# EasyEDA Pro project modular_design.eprj, schematic Schematic1

## Sheets
1 P0_MCU_extend: Board Name: Board1; Create Date: 2026-06-22; Page Name: P0_MCU_extend; Project Name: modular_design; Schematic Name: Schematic1; Update Date: 2026-07-07; Add into BOM: yes; Company: 嘉立创EDA; Convert to PCB: yes; Page Size: A4; Version: V1.0
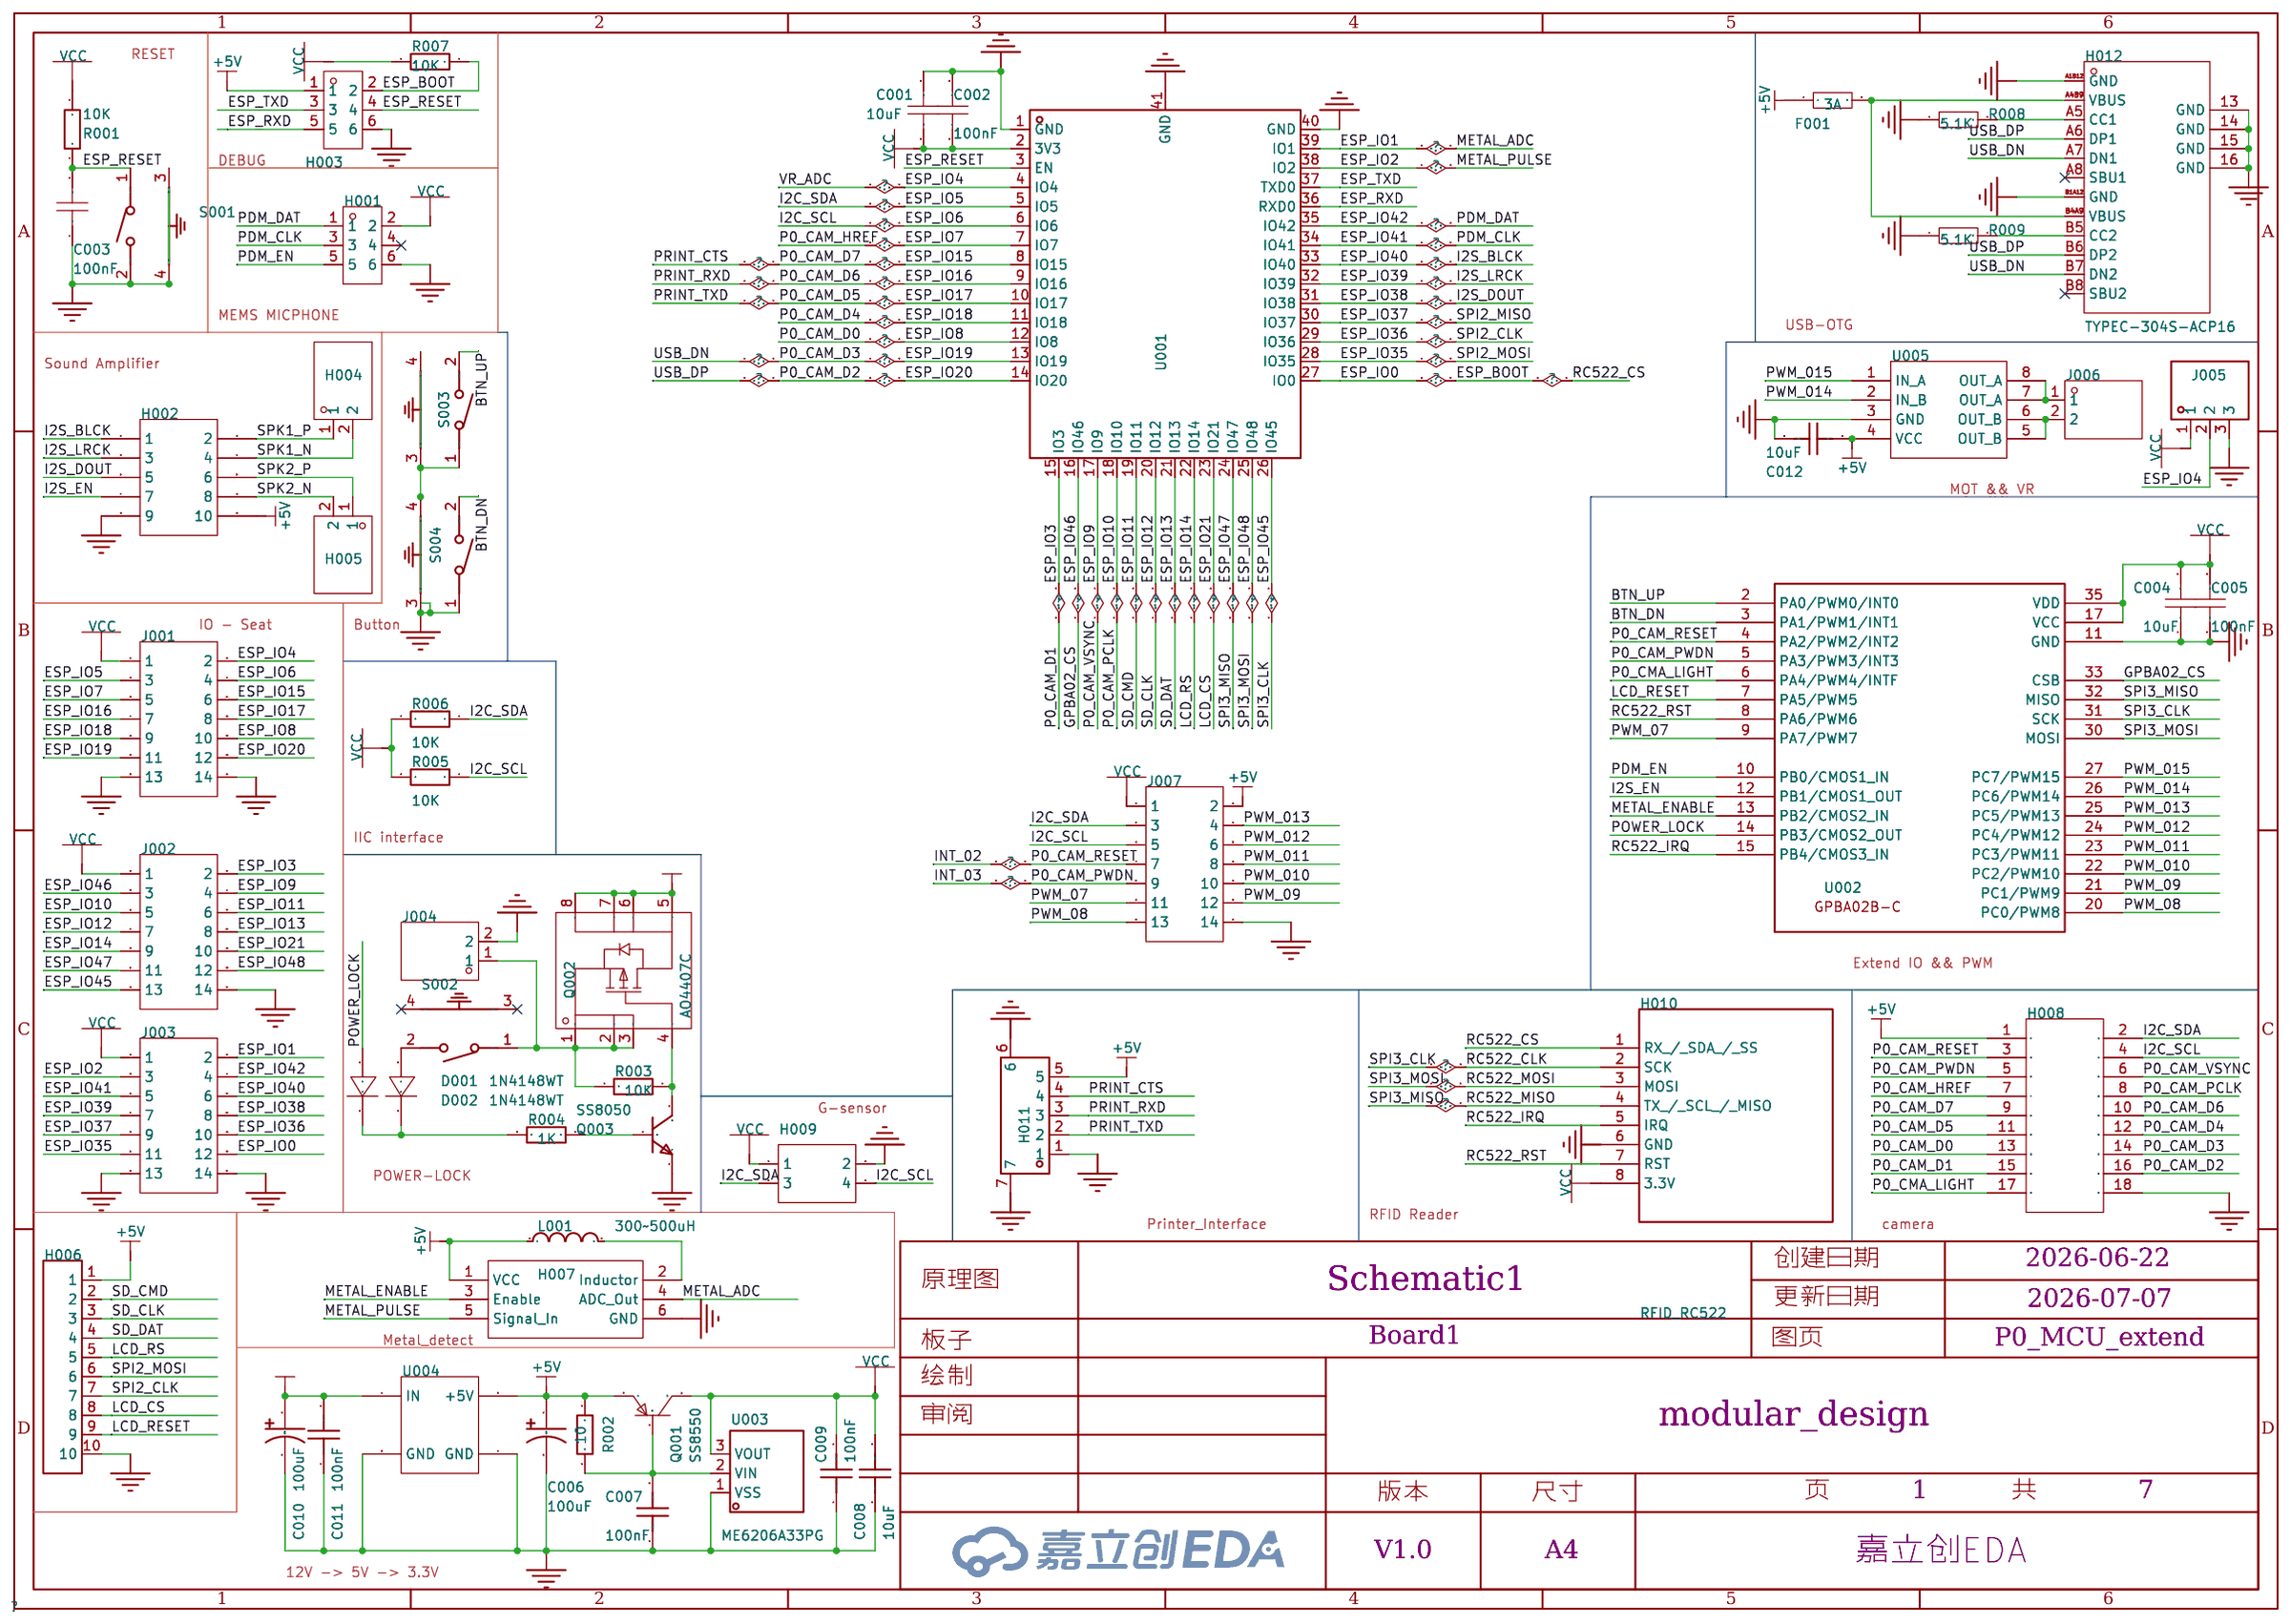
[diagram p0: P0_MCU_extend]
2 P1_mic_amp_debug: Create Date: 2026-06-24; Page Name: P1_mic_amp_debug
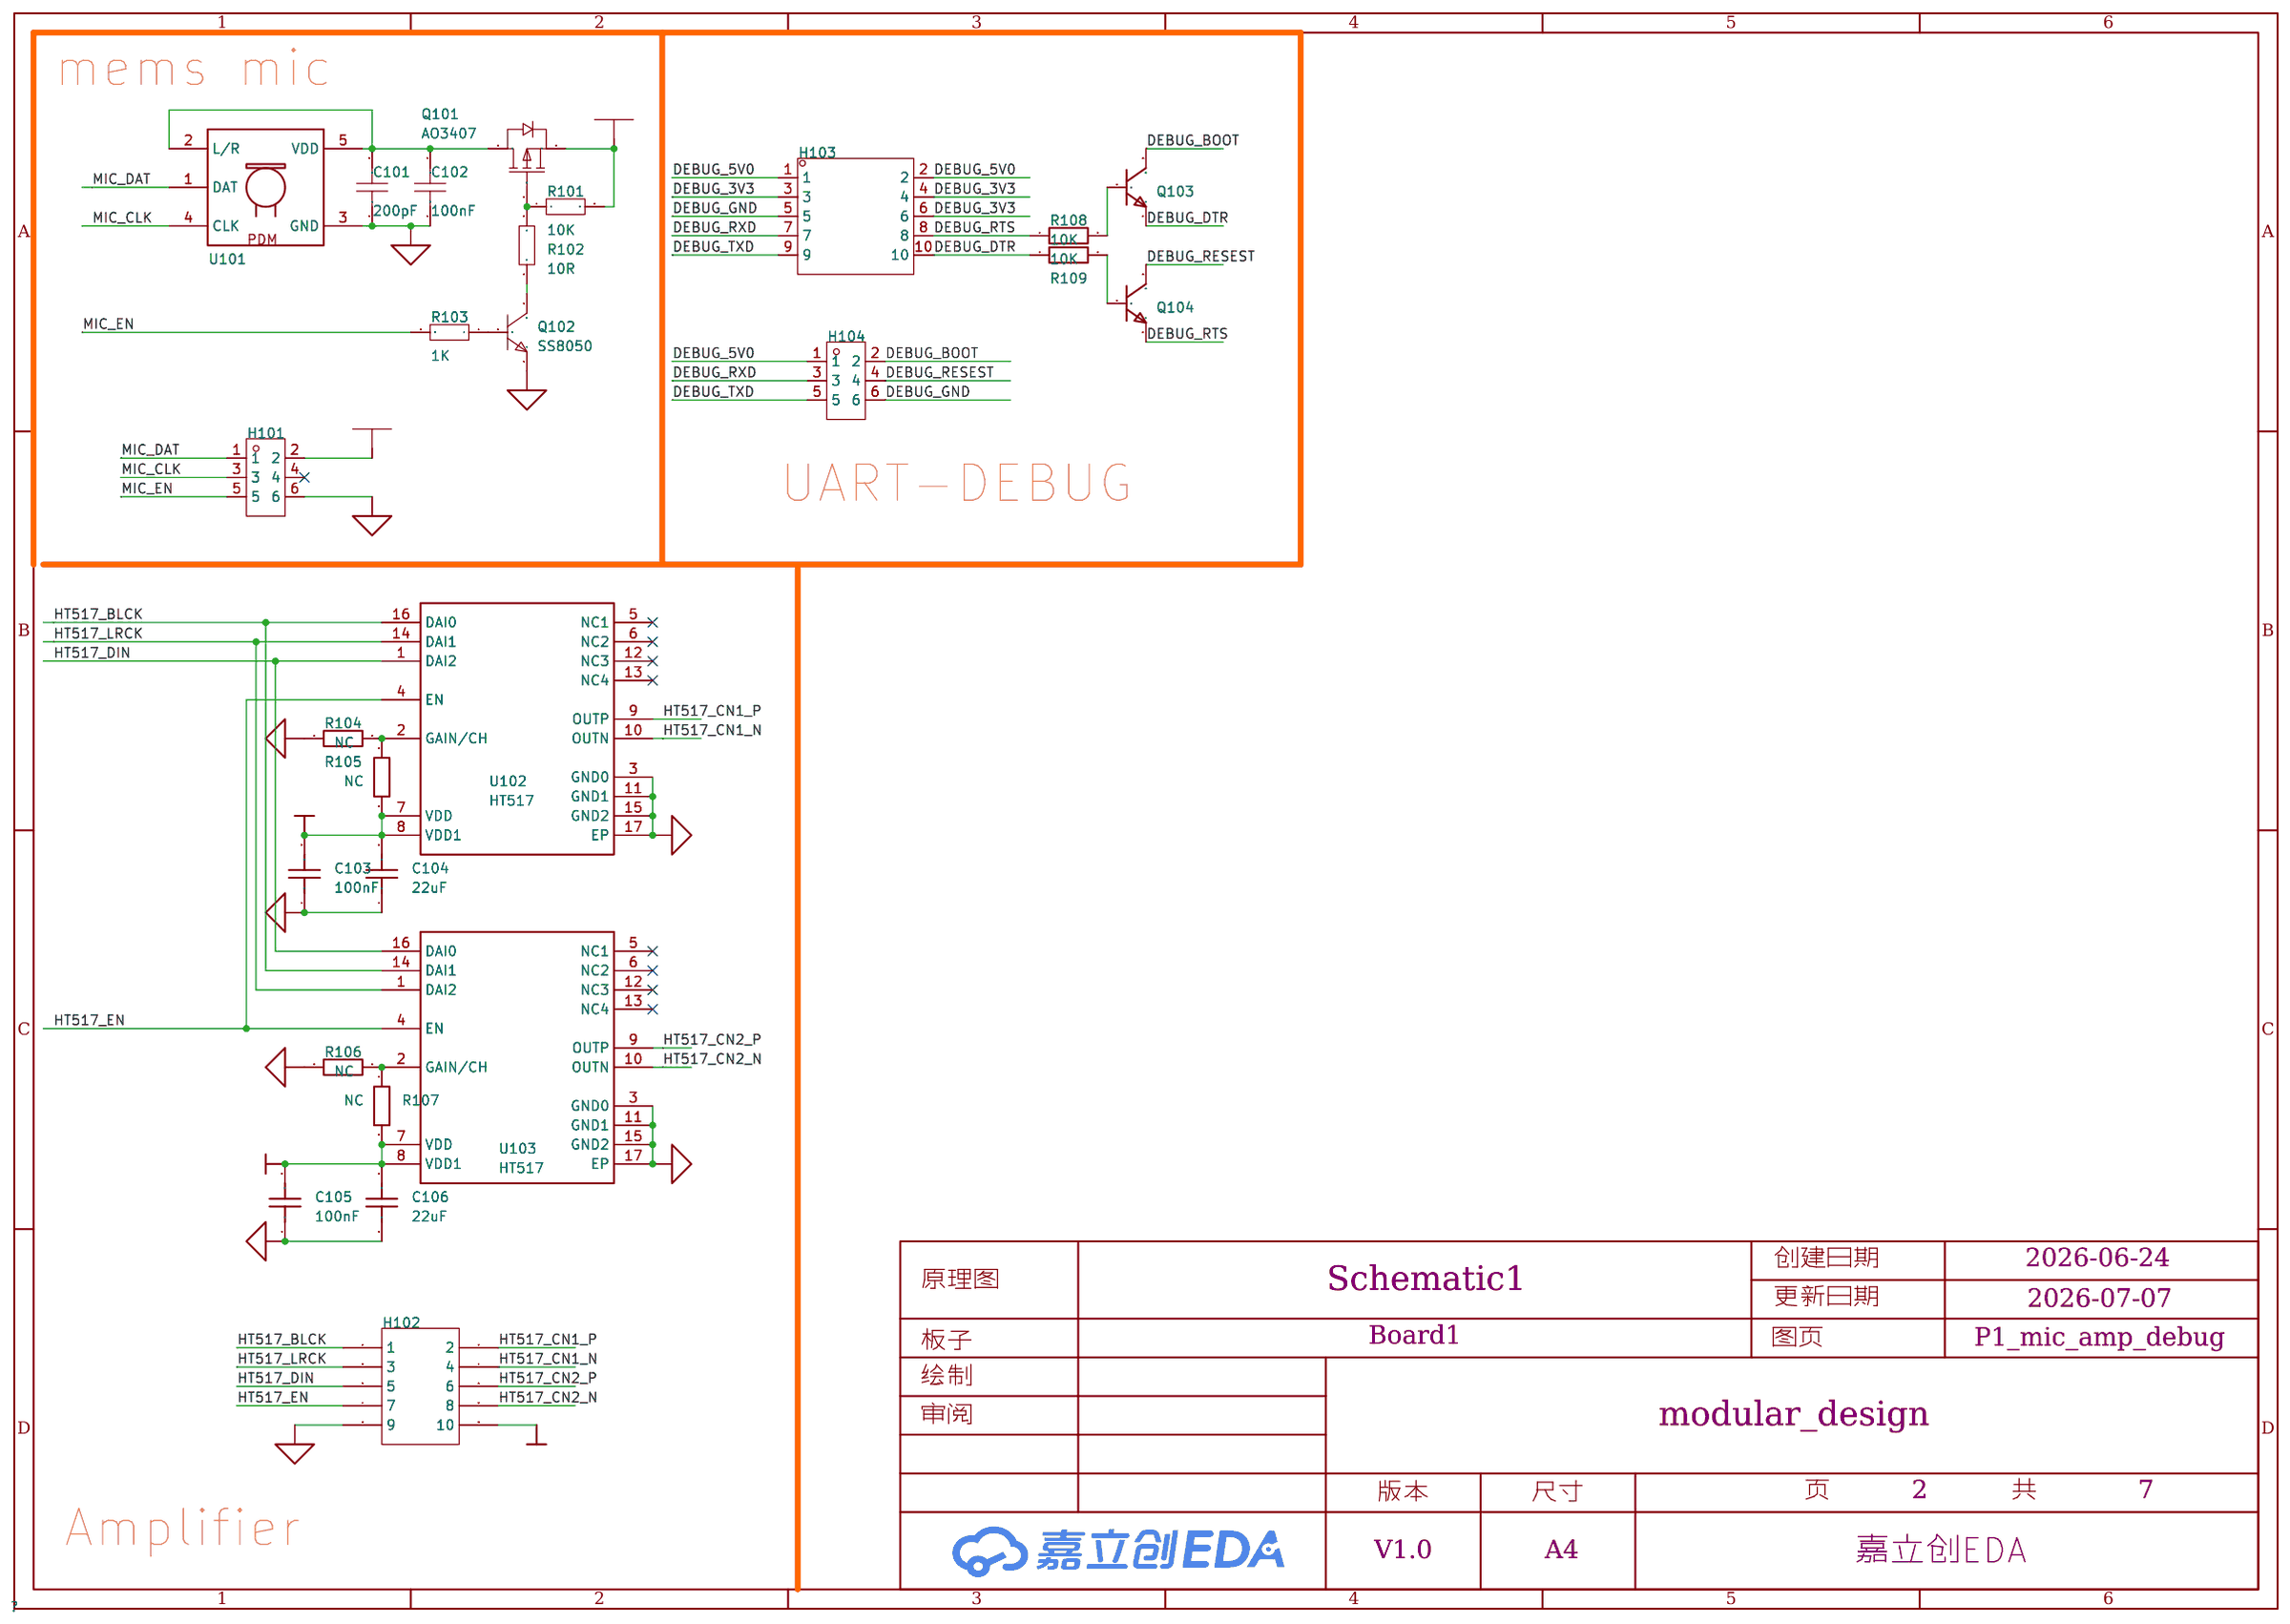
[diagram p1: P1_mic_amp_debug]
3 P2_LCD_SD: Create Date: 2026-06-30; Page Name: P2_LCD_SD
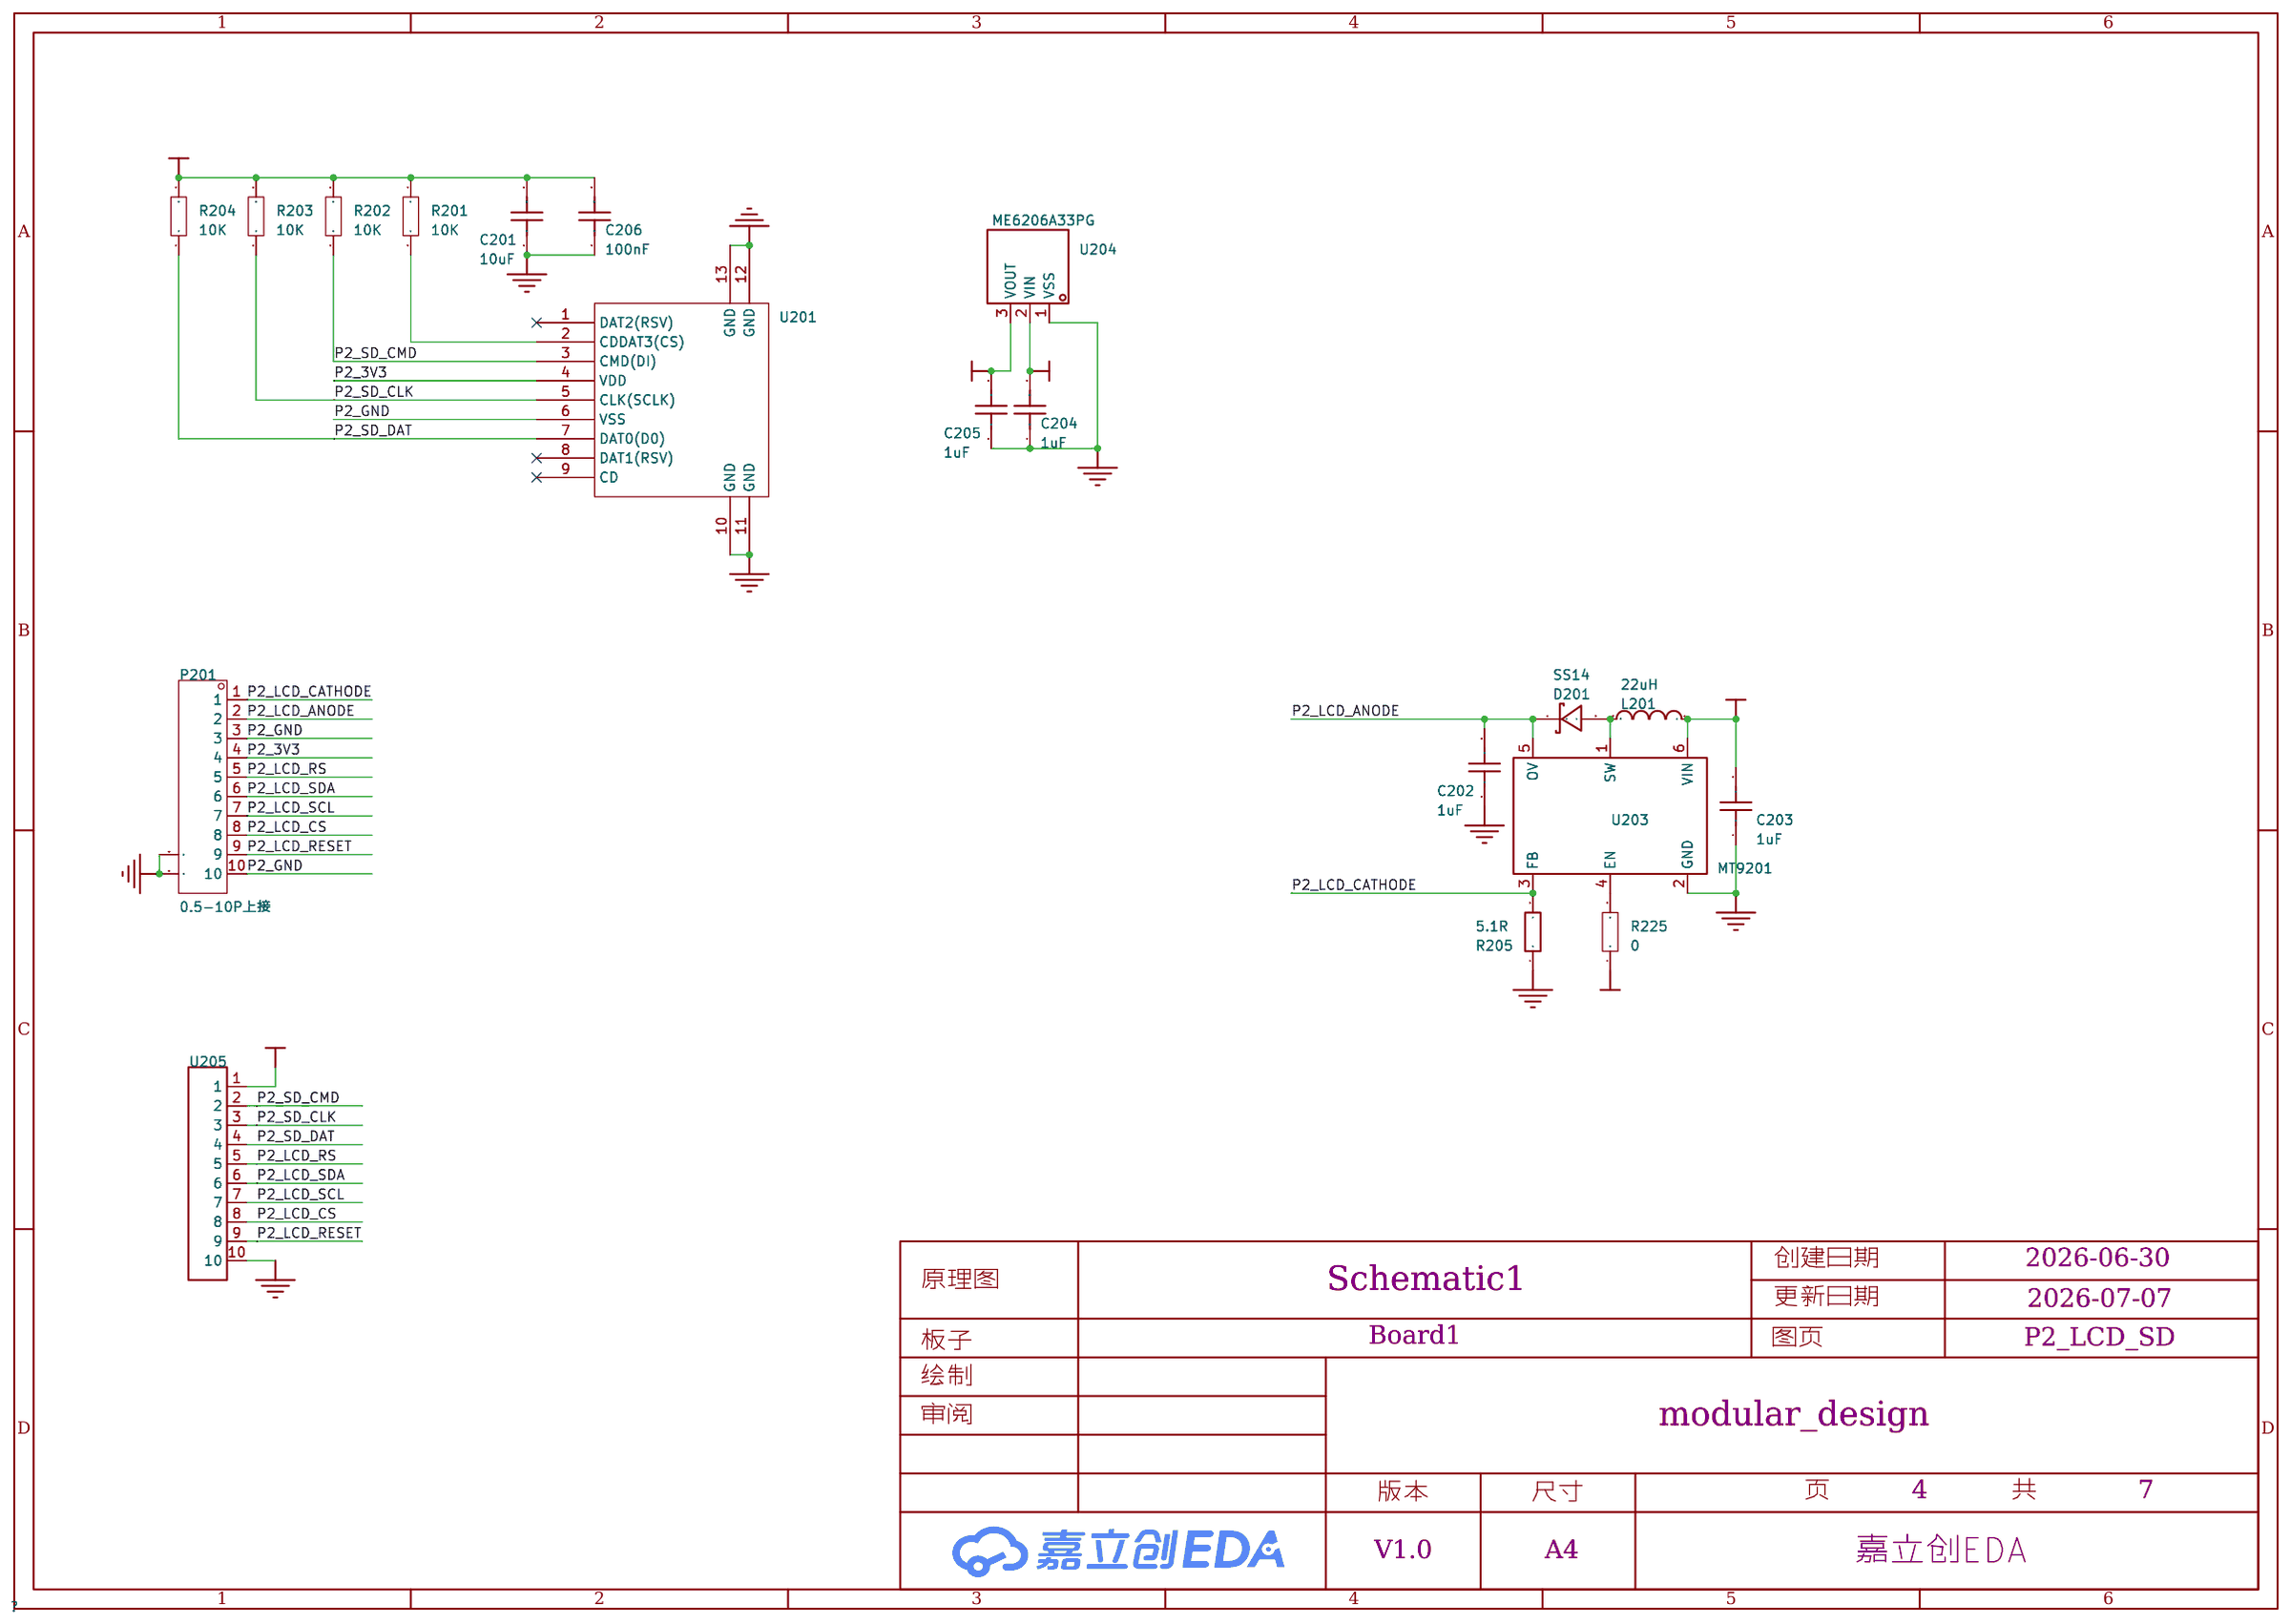
[diagram p2: P2_LCD_SD]
4 P4_metal_detect: Create Date: 2026-07-01; Page Name: P4_metal_detect; Update Date: 2026-07-01
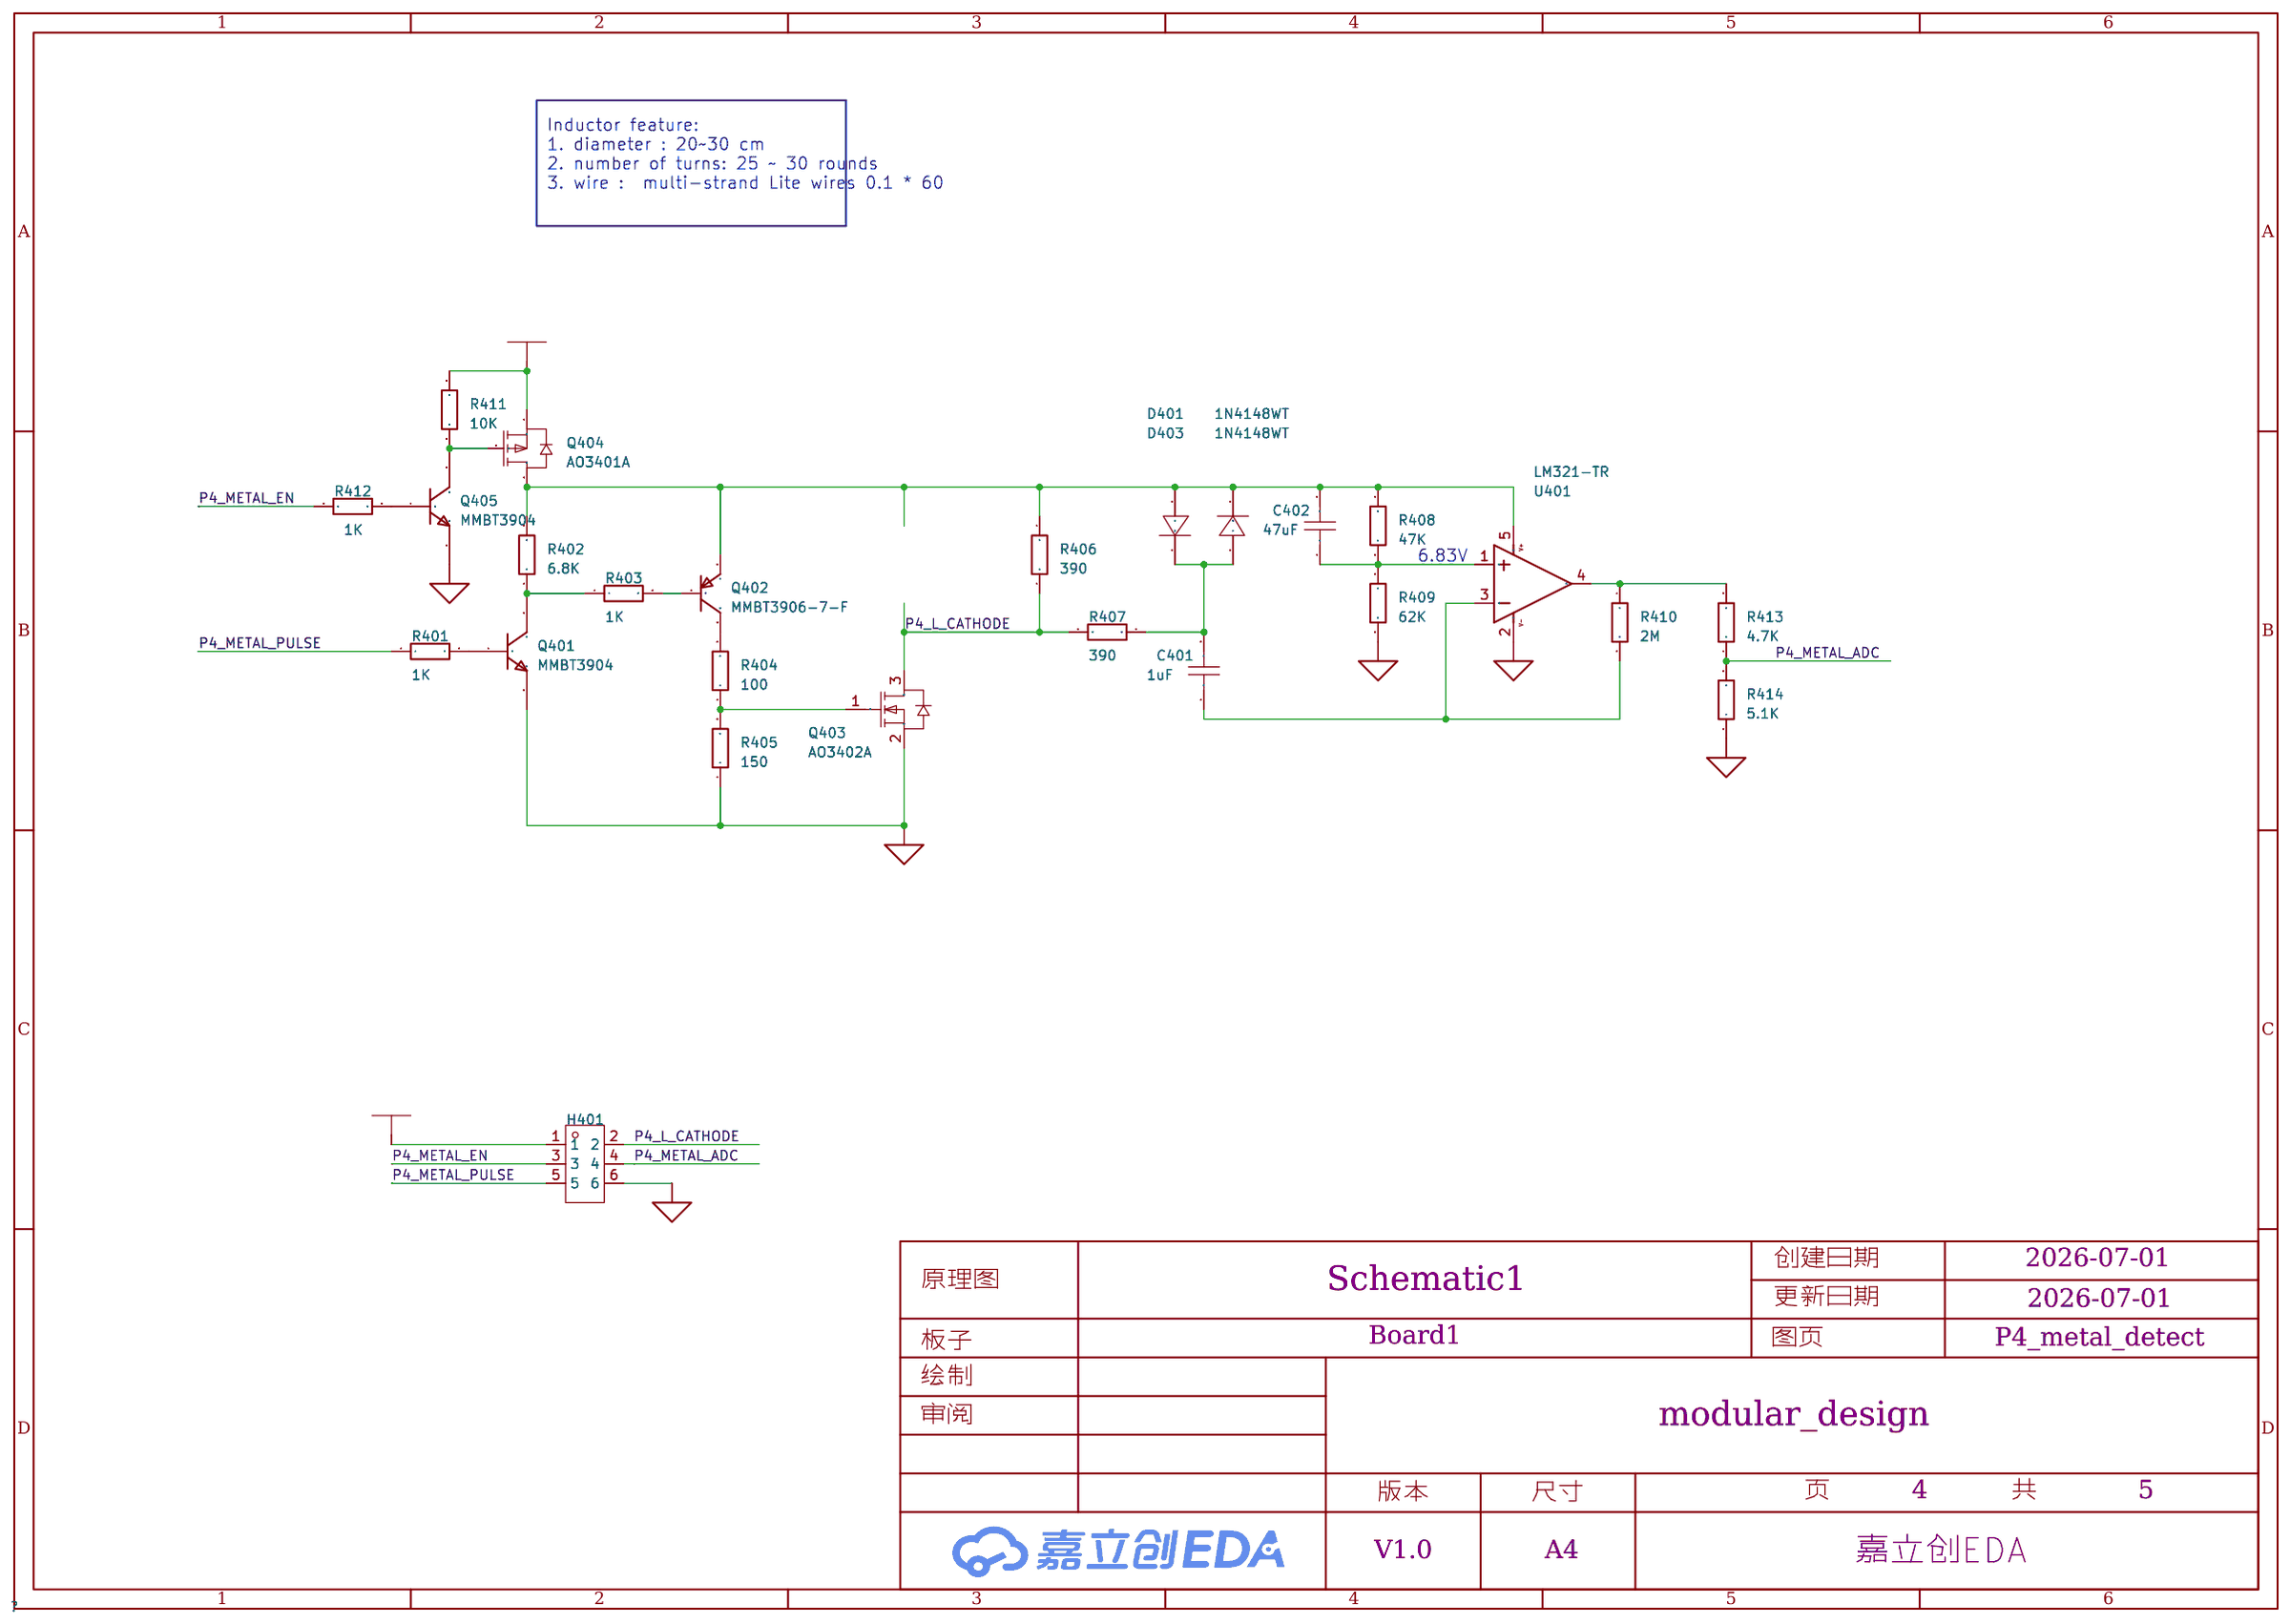
[diagram p3: P4_metal_detect]
5 P3_Charger: Create Date: 2026-07-01; Page Name: P3_Charger; Update Date: 2026-07-06
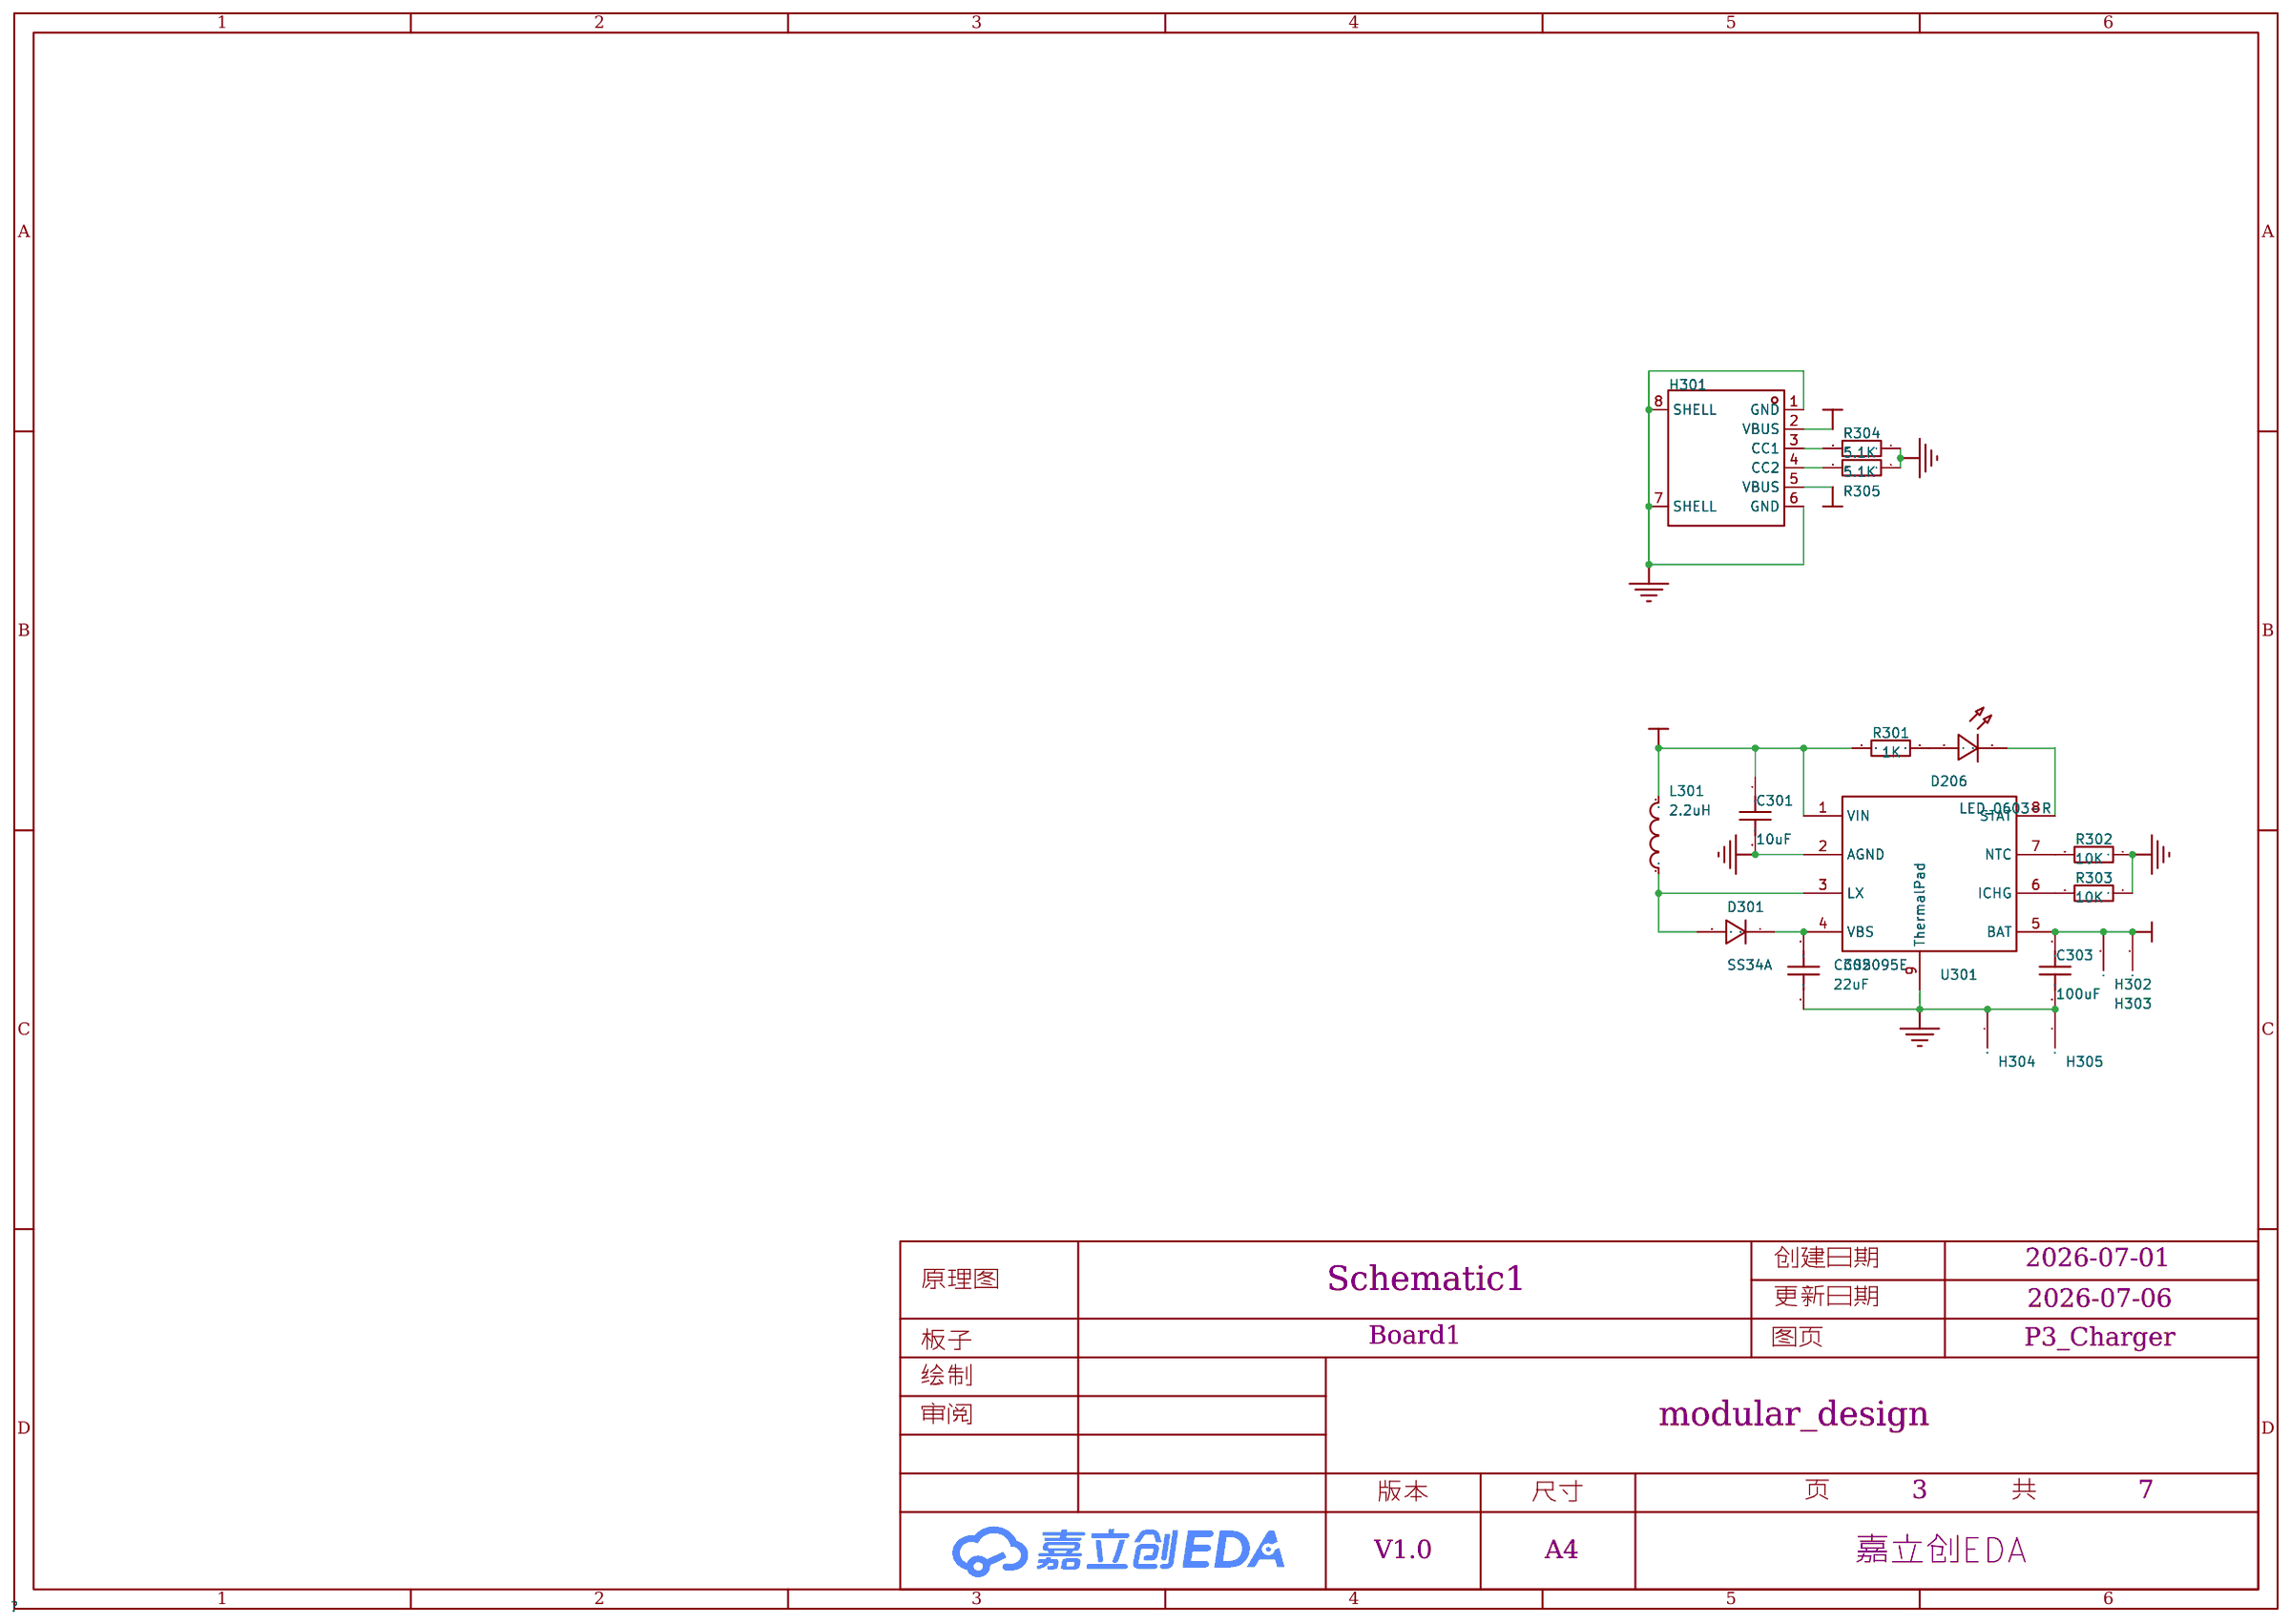
[diagram p4: P3_Charger]
6 P5_camera: Create Date: 2026-07-06; Page Name: P5_camera; Update Date: 2026-07-06
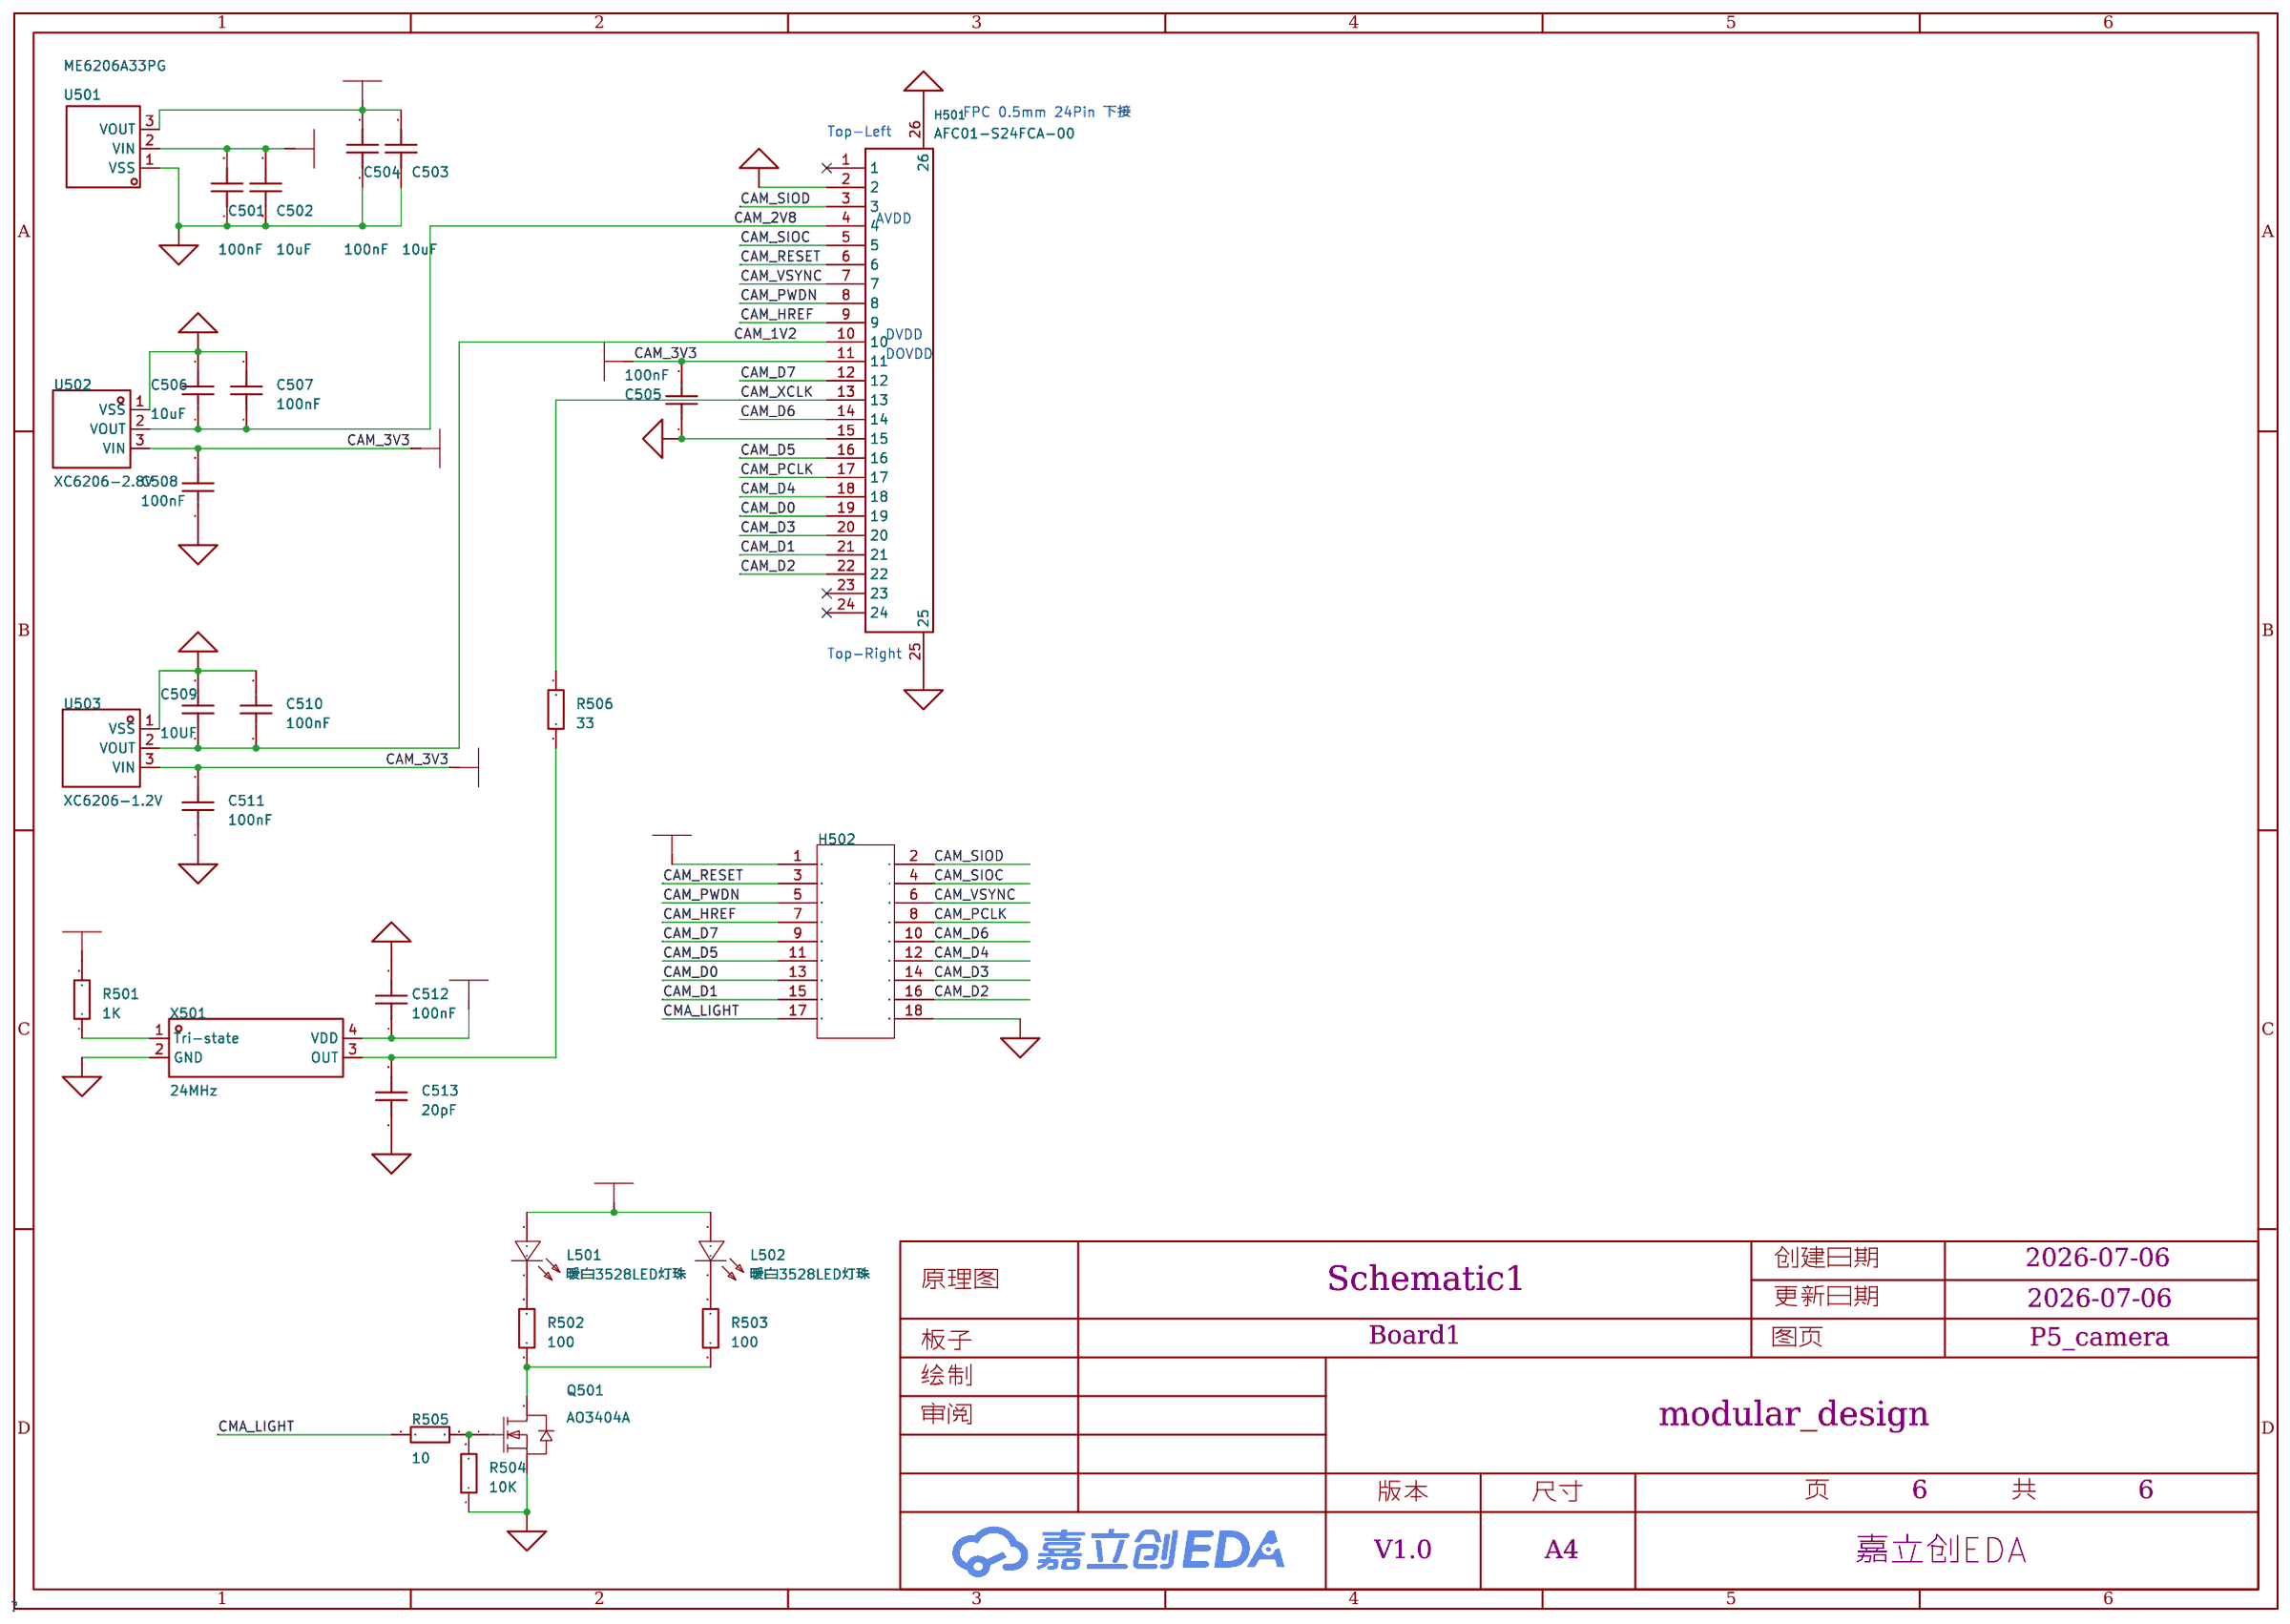
[diagram p5: P5_camera]
7 P6_Gsensor: Create Date: 2026-07-07; Page Name: P6_Gsensor
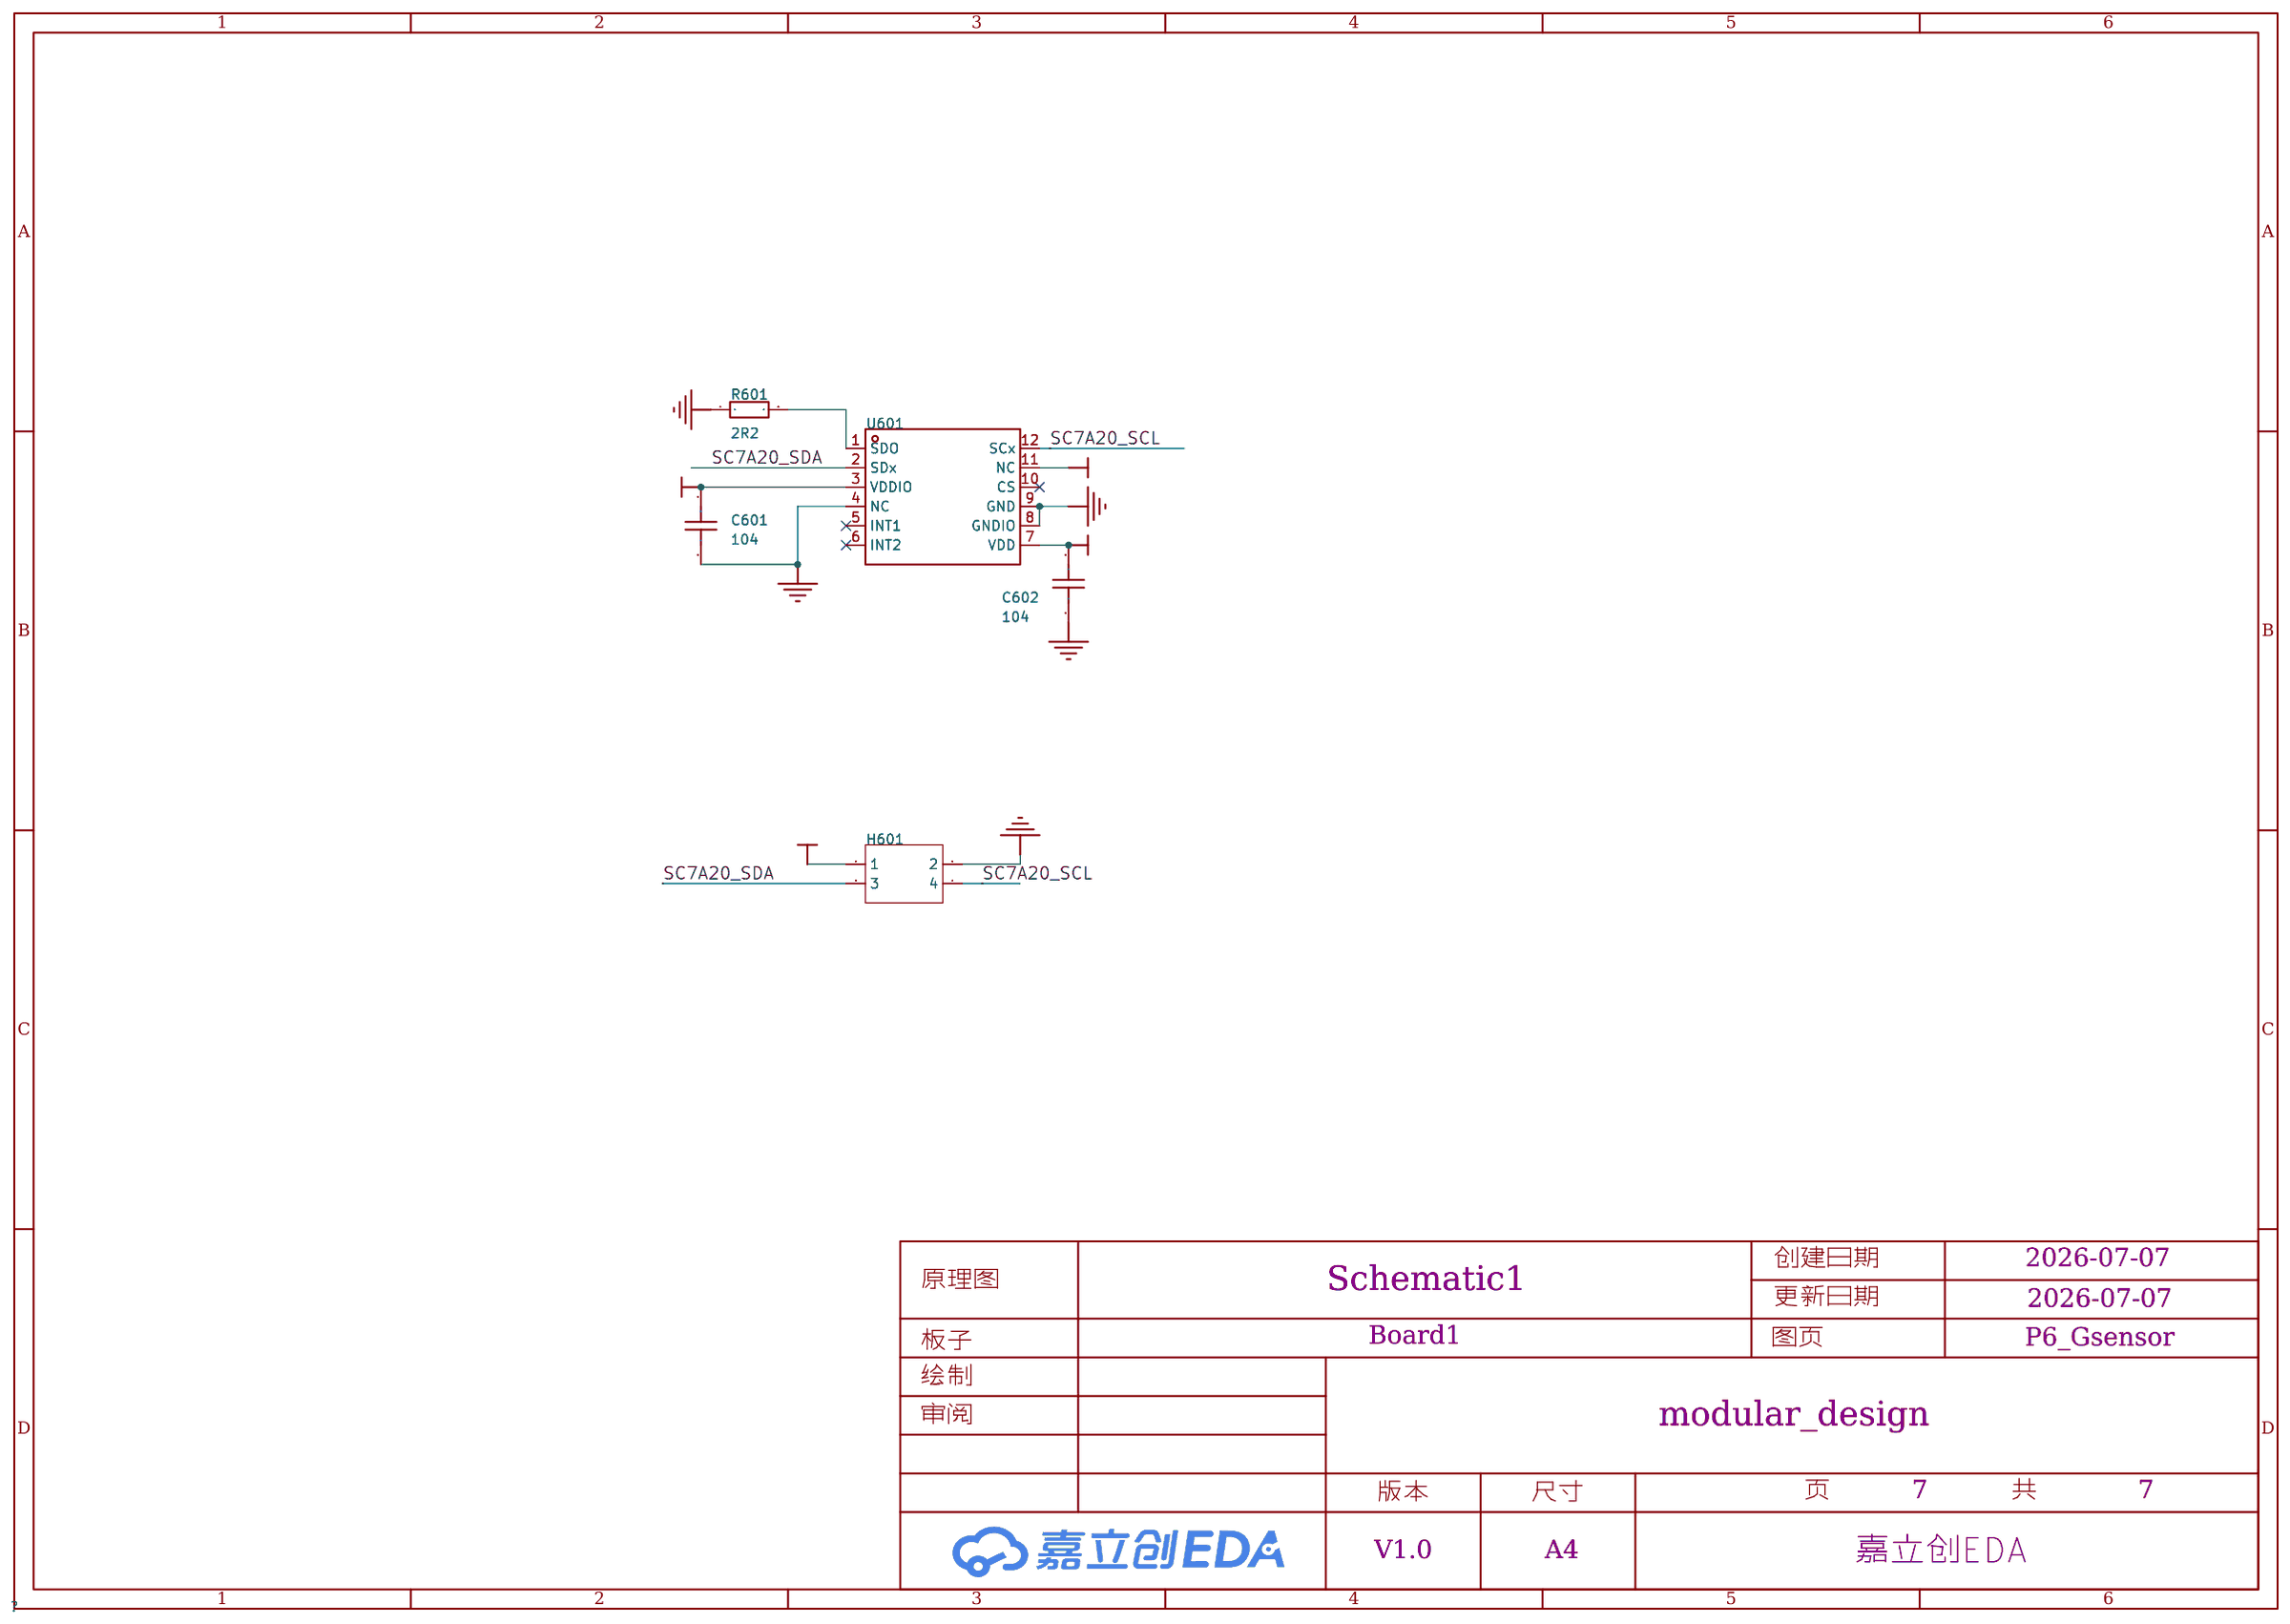
[diagram p6: P6_Gsensor]

## Parts
sheet P0_MCU_extend
C001  10uF  [C0805]
C002  100nF  [C0603]
C003  100nF  [C0603]
C004  10uF  [C0805]
C005  100nF  [C0603]
C006  100uF  [CAP-SMD_BD6.3-L6.6-W6.6-LS7.2-R-RD]
C007  100nF  [C0805]
C008  10uF  [C0805]
C009  100nF  [C0805]
C010  100uF  [CAP-SMD_BD6.3-L6.6-W6.6-LS7.2-R-RD]
C011  100nF  [C0805]
C012  10uF  [C0805]
D001  1N4148WT  [SOD-523_L1.2-W0.8-LS1.6-RD]
D002  1N4148WT  [SOD-523_L1.2-W0.8-LS1.6-RD]
F001  10K  [R0805]
H001  PZ254V-12-6P  [PDM_MODULE]
H002  -  [I2S_HT517_STEREO]
H003  PZ254V-12-6P  [CH343_DEBUG]
H004  B2B-ZR(LF)(SN)  [CONN-TH_B2B-ZR-LF-SN]
H005  B2B-ZR(LF)(SN)  [CONN-TH_B2B-ZR-LF-SN]
H006  -  [connector_p10_1.5mm]
H007  -  [Metal_Detect]
H008  -  [connector_p2*9_2.54]
H009  A2541HWV-2x2P  [SC7A20_MODULE]
H010  RFID_RC522  [RFID_RC522]
H011  HX20007-5AWB  [CONN-SMD_5P-P2.00_HX20007-5AWB]
H012  TYPEC-304S-ACP16  [USB-C-SMD_TYPEC-304S-ACP16]
J001  2.54-2*7P母  [HDR-TH_14P-P2.54-V-F-R2-C7-S2.54-1]
J002  2.54-2*7P母  [HDR-TH_14P-P2.54-V-F-R2-C7-S2.54-1]
J003  2.54-2*7P母  [HDR-TH_14P-P2.54-V-F-R2-C7-S2.54-1]
J004  B2B-ZR(LF)(SN)  [connector_p2_2.0mm]
J005  -  [conn-dip-1*3-1.5mm]
J006  B2B-ZR(LF)(SN)  [CONN-TH_B2B-ZR-LF-SN]
J007  2.54-2*7P母  [HDR-TH_14P-P2.54-V-F-R2-C7-S2.54-1]
L001  470uH  [connector_p2_2.0mm]
Q001  SS8550  [SOT-23-3_L2.9-W1.4-P1.90-LS2.6-BR]
Q002  AO4407C  [SOP-8_L4.9-W3.9-P1.27-LS6.0-BL]
Q003  SS8050  [SOT-23-3_L2.9-W1.3-P1.90-LS2.4-BR]
R001  10K  [R0603]
R002  10K  [R0603]
R003  10K  [R0603]
R004  10K  [R0603]
R005  10K  [R0603]
R006  10K  [R0603]
R007  10K  [R0603]
R008  10K  [R0603]
R009  10K  [R0603]
S001  TC-1102N-C-A-B  [SW-TH_TC-1102N-C-A-B]
S002  TC-1102N-C-A-B  [SW-TH_TC-1102N-C-A-B]
S003  TC-1102N-C-A-B  [SW-TH_TC-1102N-C-A-B]
S004  TC-1102N-C-A-B  [SW-TH_TC-1102N-C-A-B]
U001  -  [ESP32-S3-WROOM-1U]
U002  -  [GPBA02B-C]
U003  ME6206A33PG  [SOT-89-3_L4.5-W2.5-P1.50-LS4.2-BR]
U004  -  [CX8823_MO]
U005  -  [sop-8_l5.0-w4.0-p1.27-ls6.2-bl]
sheet P1_mic_amp_debug
C101  100nF  [C0603]
C102  100nF  [C0603]
C103  100nF  [C0805]
C104  100nF  [C0805]
C105  100nF  [C0805]
C106  100nF  [C0805]
H101  PZ254V-12-6P  [Finger_2*3]
H102  -  [Finger_2*5]
H103  MTP125-1205S1  [HDR-TH_10P-P2.54-V-M-R2-C5-S2.54]
H104  PZ254V-12-6P  [Finger_2*3]
Q101  AO3407  [SOT-23-3_L2.9-W1.3-P1.90-LS2.4-BR]
Q102  SS8050  [SOT-23-3_L2.9-W1.3-P1.90-LS2.4-BR]
Q103  SS8050  [SOT-23-3_L2.9-W1.3-P1.90-LS2.4-BR]
Q104  SS8050  [SOT-23-3_L2.9-W1.3-P1.90-LS2.4-BR]
R101  10K  [R0603]
R102  10R  [R0603]
R103  1K  [R0603]
R104  NC  [R0603]
R105  NC  [R0603]
R106  NC  [R0603]
R107  NC  [R0603]
R108  NC  [R0603]
R109  NC  [R0603]
U101  -  [SD18OB261-104]
U102  HT517  [QFN-16_L3.0-W3.0-P0.50-TL-EP1.7]
U103  HT517  [QFN-16_L3.0-W3.0-P0.50-TL-EP1.7]
sheet P2_LCD_SD
C201  100nF  [C0603]
C202  100nF  [C0805]
C203  100nF  [C0805]
C204  100nF  [C0603]
C205  100nF  [C0603]
C206  100nF  [C0603]
D201  SS14  [SMA_L4.3-W2.6-LS5.2-RD]
L201  22uH  [IND-SMD_L4.0-W4.0]
P201  0.5-10P上接  [FPC_0.5_10P_mirror]
R201  10K  [R0603]
R202  10K  [R0603]
R203  10K  [R0603]
R204  10K  [R0603]
R205  10K  [R0603]
R225  10K  [R0603]
U201  -  [TF-01A]
U203  MT9201  [SOT-23-6_L2.9-W1.6-P0.95-LS2.8-BR]
U204  ME6206A33PG  [SOT-89-3_L4.5-W2.5-P1.50-LS4.2-BR]
U205  -  [connector_p10_1.5mm]
sheet P3_Charger
C301  10uF  [C0805]
C302  22uF  [C0805]
C303  100uF  [C0805]
D206  LED_0603-R  [LED_0603]
D301  SS34A  [SMA_L4.3-W2.6-LS5.2-RD]
H301  -  [typec-31-e-11]
H302  -  [Single_Pin]
H303  -  [Single_Pin]
H304  -  [Single_Pin]
H305  -  [Single_Pin]
L301  4.7uH  [IND-SMD_L5.8-W5.2]
R301  1K  [R0603]
R302  10K  [R0603]
R303  10K  [R0603]
R304  10K  [R0603]
R305  10K  [R0603]
U301  CS5095E  [ESOP-8_L4.9-W3.9-P1.27-LS6.0-BL-EP]
sheet P4_metal_detect
C401  1uF  [C0603]
C402  1uF  [C0805]
D401  1N4148WT  [SOD-523_L1.2-W0.8-LS1.6-RD]
D403  1N4148WT  [SOD-523_L1.2-W0.8-LS1.6-RD]
H401  PZ254V-12-6P  [Finger_2*3]
Q401  MMBT3904  [SOT-23-3_L2.9-W1.3-P1.90-LS2.4-BR]
Q402  MMBT3906-7-F  [SOT-23-3_L2.9-W1.6-P1.90-LS2.8-BR]
Q403  AO3402A  [SOT-23-3_L2.9-W1.3-P1.90-LS2.4-BR]
Q404  AO3401A  [SOT-23_L2.9-W1.3-P1.90-LS2.4-BR]
Q405  MMBT3904  [SOT-23-3_L2.9-W1.3-P1.90-LS2.4-BR]
R401  10K  [R0603]
R402  10K  [R0603]
R403  10K  [R0603]
R404  10K  [R0603]
R405  10K  [R0603]
R406  10K  [R0603]
R407  10K  [R0603]
R408  10K  [R0603]
R409  10K  [R0603]
R410  10K  [R0603]
R411  10K  [R0603]
R412  10K  [R0603]
R413  10K  [R0603]
R414  10K  [R0603]
U401  LM321-TR  [SOT-23-5_L3.0-W1.7-P0.95-LS2.8-BR]
sheet P5_camera
C501  100nF  [C0603]
C502  10uF  [C0603]
C503  10uF  [C0603]
C504  100nF  [C0603]
C505  0.1UF  [C0603]
C506  10UF  [C0603]
C507  0.1UF  [C0603]
C508  0.1UF  [C0603]
C509  10UF  [C0603]
C510  0.1UF  [C0603]
C511  0.1UF  [C0603]
C512  100nF  [C0603]
C513  20pF  [C0603]
H501  AFC01-S24FCA-00  [FPC-SMD_P0.50-24P_FGS-XJ-H2.0]
H502  -  [Finger_2*9]
L501  暖白3528LED灯珠  [LED-SMD_L3.6-W2.9-R-RD]
L502  暖白3528LED灯珠  [LED-SMD_L3.6-W2.9-R-RD]
Q501  AO3404A  [SOT-23_L2.9-W1.3-P1.90-LS2.4-BR]
R501  1K  [R0603]
R502  1K  [R0603]
R503  1K  [R0603]
R504  1K  [R0603]
R505  1K  [R0603]
R506  1K  [R0603]
U501  ME6206A33PG  [SOT-89-3_L4.5-W2.5-P1.50-LS4.2-BR]
U502  XC6206-2.8V  [SOT-23-3_L2.9-W1.6-P1.90-LS2.8-BR]
U503  XC6206-1.2V  [SOT-23-3_L2.9-W1.6-P1.90-LS2.8-BR]
X501  24MHz  [OSC-SMD_4P-L3.2-W2.5-BL]
sheet P6_Gsensor
C601  104  [C0603]
C602  104  [C0603]
H601  A2541HWV-2x2P  [Finger_2*2]
R601  10K  [R0603]
U601  -  [LGA-12_L2.0-W2.0-P0.50-TL]

## Library data of the parts
C001 C004 C401 C402 = CC0805ZKY5V7BB106: LCSC Part Name: 10uF -20%~+80% 16V; Supplier Part: C106836; Manufacturer: YAGEO(国巨); Supplier Footprint: 0805; JLCPCB Part Class: Extended Part; Datasheet: https://atta.szlcsc.com/upload/public/pdf/source/20170523/1495533897565.pdf; Supplier: LCSC; Temperature Coefficient: Y5V; Tolerance: -20%~+80%; Voltage Rated: 16V
C002 C003 C005 C007 C008 C009 C011 C012 C101-C106 C201-C206 C301-C303 C501-C513 = CAP_0603: Supplier Footprint: 0603
C006 C010 = VEJ101M1CTR-0605: LCSC Part Name: 100uF ±20% 16V; Supplier Part: C164064; Manufacturer: lelon(立隆); Supplier Footprint: SMD,6.3x5.3mm; JLCPCB Part Class: Extended Part; Datasheet: https://atta.szlcsc.com/upload/public/pdf/source/20180126/C164064_15169515392981308320.pdf; Supplier: LCSC; Tolerance: ±20%; Rated Voltage: 16V; φD: 6.3mm; L: 5.3mm; Lifetime @ Temp: 2000hrs@105℃; Operating Temperature: -45℃~+105℃
D001 D002 D401 D403 = 1N4148WT: LCSC Part Name: 75V 300mA 4ns; Supplier Part: C232841; Manufacturer: onsemi(安森美); Supplier Footprint: SOD-523F; JLCPCB Part Class: Extended Part; Datasheet: https://atta.szlcsc.com/upload/public/pdf/source/20181222/C232841_42C5BA49E5A441BB8F6B91D0F4CD0D51.pdf; Supplier: LCSC; Diode Configuration: 独立式; Power Dissipation: 200mW; Reverse Voltage (Vr): 75V; Average Rectified Current (Io): 300mA; Forward Voltage (Vf@If): 1V@10mA; Reverse Leakage Current: 5μA@75V; Reverse Recovery Time (trr): 4ns; Operating Temperature: -55℃~+150℃@(Tj)
F001 R001 R002 R003 R004 R005 R006 R007 R008 R009 R101-R103 R201-R205 R225 R301-R305 R401-R414 R501-R506 R601 = Res_0603: Supplier Footprint: 0603
H001 H003 H101 H104 H401 = PZ254V-12-6P: LCSC Part Name: 2.54mm 2x3P 直插 方针; Supplier Part: C492420; Manufacturer: XFCN(兴飞); Supplier Footprint: 插件,P=2.54mm; JLCPCB Part Class: Extended Part; Datasheet: https://atta.szlcsc.com/upload/public/pdf/source/20200309/C492420_BAECB307B001054C09D200388220EAE6.pdf; Supplier: LCSC; Pitch: 2.54mm; Number of Pins: 6; Number of Rows: 2; Pin Structure: 2x3P; Row Spacing: 2.54mm; Mounting Type: 直插; Circluar Pins/Square Pins: 方针; Length of Mating Pin: 6mm; Insulation Height: 2.5mm; Length of End Connection Pin: 3mm; Contact Material: 黄铜; Operating Temperature Range: -40℃~+105℃; Color: 黑色
H002 H102 = Finger_2*5
H004 H005 J004 J006 = B2B-ZR(LF)(SN): LCSC Part Name: B2B-ZR (LF)(SN); Supplier Part: C158011; Manufacturer: JST; Supplier Footprint: 插件,P=1.5mm; JLCPCB Part Class: Extended Part; Datasheet: https://atta.szlcsc.com/upload/public/pdf/source/20181223/C158011_6CFD0C70F58E1854900B8AF425FE5444.pdf; Supplier: LCSC; Pitch: 1.5mm; Pins Structure: 1x2P; Number of Rows: 1; Number of PINs Per Row: 2; Contact Material: 黄铜
H006 U205 = connector_p10_1.5mm
H007 = Metal_Detect
H008 H502 = conn-2*9p
H009 H601 = A2541HWV-2x2P: LCSC Part Name: 2.54mm 2x2P; Supplier Part: C239342; Manufacturer: CJT(长江连接器); Supplier Footprint: 直插,P=2.54mm; JLCPCB Part Class: Extended Part; Datasheet: https://atta.szlcsc.com/upload/public/pdf/source/20180724/C239342_948074203011CE30B776F48EA8B1A8F2.pdf; Supplier: LCSC; Pitch: 2.54mm; Number of Holes: 4; Number of Rows: 2; Holes Structure: 2x2P; Row Spacing: 2.54mm; Mounting Type: 直插; Contact Material: 黄铜; Contact Plating: 金
H010 = RFID_RC522
H011 = HX20007-5AWB: LCSC Part Name: 母座 卧贴 2.0mm 5Pin位 母座; Supplier Part: C442225; Manufacturer: HX(红星); Supplier Footprint: SMD,P=2mm; JLCPCB Part Class: Extended Part; Datasheet: https://atta.szlcsc.com/upload/public/pdf/source/20191028/C442225_DDD2455535F7EA1D3D205E5EFB10C902.pdf; Supplier: LCSC; Reference Series: PH; Pitch: 2mm; Pins Structure: 1x5P; Number of Rows: 1; Number of PINs Per Row: 5; Gender: 公型插针; Mounting Style: 卧贴
H012 = TYPEC-304S-ACP16: LCSC Part Name: Type-C 母座 卧贴; Supplier Part: C720630; Manufacturer: XUNPU(讯普); Supplier Footprint: SMD; JLCPCB Part Class: Extended Part; Datasheet: https://atta.szlcsc.com/upload/public/pdf/source/20200812/C720630_4E8E536EF3694A171163775BA200E634.pdf; Supplier: LCSC; Connector Type: Type-C; Standard: USB 3.1; Gender: 母座; Number of Contacts: 16; Number of Ports: 1; Mounting Style: 卧贴; Current Rating - Power (Max): 3A; Operating Temperature Range: -45℃~+85℃; Welding Temperature (Max): 260℃
J001 J002 J003 J007 = 2.54-2*7P母: LCSC Part Name: 2.54mm 2x7P; Supplier Part: C38844; Manufacturer: BOOMELE(博穆精密); Supplier Footprint: 直插,P=2.54mm; JLCPCB Part Class: Extended Part; Datasheet: https://atta.szlcsc.com/upload/public/pdf/source/20151109/1457707558102.pdf; Supplier: LCSC; Pitch: 2.54mm; Number of Holes: 14; Number of Rows: 2; Holes Structure: 2x7P; Row Spacing: 2.54mm; Mounting Type: 直插; Contact Material: 黄铜
J005 = conn-1*3p
L001 = CKL0514-470uH/J-CCA T: LCSC Part Name: 470uH ±5% 280mA 3.22Ω; Supplier Part: C354673; Manufacturer: CENKER(岑科); Supplier Footprint: 轴向引线; JLCPCB Part Class: Extended Part; Datasheet: https://atta.szlcsc.com/upload/public/pdf/source/20190315/C354673_825EB25F3EB411343FC5F933A0BC0339.pdf; Supplier: LCSC; Type: 色环电感; Tolerance: ±5%; Rated Current: 280mA; DC Resistance: 3.22Ω
Q001 = SS8550: Supplier Part: C727138; Manufacturer: TWGMC(台湾迪嘉); Supplier Footprint: SOT-23; JLCPCB Part Class: Extended Part; Datasheet: https://atta.szlcsc.com/upload/public/pdf/source/20200827/C727138_BA615C6C75A6E3189106DA068B2571C1.pdf; Supplier: LCSC; Transistor Type: PNP; Collector-Emitter Breakdown Voltage (Vceo): 25V; Collector Current (Ic): 1.5A; Power Dissipation (Pd): 300mW; Collector-Emitter Saturation Voltage (VCE(sat)@Ic,Ib): 500mV@800mA,80mA; DC Current Gain (hFE@Ic,Vce): 200@100mA,1V; Transition Frequency (fT): 100MHz; Operating Temperature: +150℃@(Tj)
Q002 = AO4407C: LCSC Part Name: P沟道 30V 14A 产地：重庆; Supplier Part: C469397; Manufacturer: AOS; Supplier Footprint: SOP-8; JLCPCB Part Class: Extended Part; Datasheet: https://atta.szlcsc.com/upload/public/pdf/source/20191212/C469397_0FA240FA8DBDAEB8A8E95B002A232449.pdf; Supplier: LCSC; Type: P沟道; Drain Source Voltage (Vdss): 30V; Continuous Drain Current (Id): 14A; Power Dissipation (Pd): 3.1W; Drain Source On Resistance (RDS(on)@Vgs,Id): 11.5mΩ@10V,14A; Gate Threshold Voltage (Vgs(th)@Id): 2.3V@250μA
Q003 Q102-Q104 = SS8050: LCSC Part Name: SS8050 Y1 200-350 Y1 200-350; Supplier Part: C2150; Manufacturer: CJ（江苏长电/长晶）; Supplier Footprint: SOT-23(SOT-23-3); JLCPCB Part Class: Basic Part; Datasheet: https://atta.szlcsc.com/upload/public/pdf/source/20140809/1457707209319.pdf; Supplier: LCSC; Transistor Type: NPN; Collector-Emitter Breakdown Voltage (Vceo): 25V; Collector Current (Ic): 1.5A; Power Dissipation (Pd): 300mW; Collector-Emitter Saturation Voltage (VCE(sat)@Ic,Ib): 500mV@800mA,80mA; DC Current Gain (hFE@Ic,Vce): 200@100mA,1V; Transition Frequency (fT): 100MHz; Operating Temperature: +150℃@(Tj)
S001 S002 S003 S004 = TC-1102N-C-A-B: LCSC Part Name: 6*6*5.0带支架 侧边按键 力度260gf 高寿命; Supplier Part: C406152; Manufacturer: XKB Connectivity(中国星坤); Supplier Footprint: 插件; JLCPCB Part Class: Extended Part; Datasheet: https://atta.szlcsc.com/upload/public/pdf/source/20211011/8943A334D21548136505FDDC6F7285B9.pdf; Supplier: LCSC; Contact Current: 50mA; Voltage Rating (DC): 12V; Insulation Resistance: 100mΩ; Circuit: 单刀单掷; Mounting Style: 卧插; Actuator Style: 圆形按钮; Actuator/Cap Color: 黑色; With Lamp: 无; Operating Force: 260gf; Mechanical Life: 300000; Operating Temperature: -30℃~+85℃; Pin Style: PC引脚; Switch Length: 6mm; Switch Width: 6mm; Switch Height: 5mm; Strike Gundam: 是
U001 = ESP32-S3-WROOM-1U
U002 = GPBA02B-C
U003 U204 U501 = ME6209A33PG: LCSC Part Name: Vin=18V Vout=3.3V 250mA; Supplier Part: C80222; Manufacturer: MICRONE(南京微盟); Supplier Footprint: SOT-89(SOT-89-3); JLCPCB Part Class: Extended Part; Datasheet: https://atta.szlcsc.com/upload/public/pdf/source/20160903/1472896599532.pdf; Supplier: LCSC; Output Type: 固定; Output Polarity: 正; Number of Outputs: 1; Maximum Input Voltage: 18V; Output Voltage: 3.3V; Dropout Voltage: 80mV@(40mA); Output Current: 250mA
U004 = CX8823_5V
U005 = AM2837
H103 = MTP125-1205S1: LCSC Part Name: 2.54mm 2x5P 直插 方针; Supplier Part: C358694; Manufacturer: MINTRON(明硕); Supplier Footprint: 直插,P=2.54mm; JLCPCB Part Class: Extended Part; Datasheet: https://atta.szlcsc.com/upload/public/pdf/source/20190124/C358694_E064CA5513580D5D1E2D2AA5B37BD31F.pdf; Supplier: LCSC; Pitch: 2.54mm; Number of Pins: 10; Number of Rows: 2; Pin Structure: 2x5P; Row Spacing: 2.54mm; Mounting Type: 直插; Circluar Pins/Square Pins: 方针; Length of Mating Pin: 6mm; Insulation Height: 2.5mm; Length of End Connection Pin: 3mm; Contact Material: 黄铜; Operating Temperature Range: -40℃~+105℃; Color: 黑色
Q101 = AO3407: LCSC Part Name: P沟道 30V 4.1A; Supplier Part: C427386; Manufacturer: MDD; Supplier Footprint: SOT-23; JLCPCB Part Class: Extended Part; Datasheet: https://atta.szlcsc.com/upload/public/pdf/source/20200323/C427386_85D7E7823FFE65CD958D58FA92E0A192.pdf; Supplier: LCSC; Type: P沟道; Drain Source Voltage (Vdss): 30V; Continuous Drain Current (Id): 4.1A; Power Dissipation (Pd): 1.2W; Drain Source On Resistance (RDS(on)@Vgs,Id): 43mΩ@10V,4A; Gate Threshold Voltage (Vgs(th)@Id): 1.6V@250uA; Total Gate Charge (Qg@Vgs): 8.2nC@10V; Input Capacitance (Ciss@Vds): 493pF@15V; Reverse Transfer Capacitance (Crss@Vds): 44pF@15V; Operating Temperature: +150℃@(Tj)
R104-R109 = 0805W8F1002T5E_C17414: Supplier: LCSC; Manufacturer: UNI-ROYAL(厚声); Manufacturer Part: 0805W8F1002T5E; JLCPCB Part Class: Basic Part; LCSC Part Name: 10kΩ ±1% 125mW 厚膜电阻; Supplier Footprint: 0805; Datasheet: https://atta.szlcsc.com/upload/public/pdf/source/20200306/C422600_1E6D84923E4A46A82E41ADD87F860B5C.pdf; Type: 厚膜电阻; Tolerance: ±1%; Power(Watts): 125mW; Overload Voltage (Max): 150V; Temperature Coefficient: ±100ppm/℃; Operating Temperature Range: -55℃~+155℃
U101 = SD18OB261-104
U102 U103 = HT517
D201 = SS14_C84343: LCSC Part Name: 40V 1A 550mV@1A; Supplier Part: C84343; Manufacturer: 星海; Supplier Footprint: SMA(DO-214AC); JLCPCB Part Class: Extended Part; Datasheet: https://atta.szlcsc.com/upload/public/pdf/source/20161024/1477288629719.pdf; Supplier: LCSC; Reverse Voltage (Vr): 40V; Average Rectified Current (Io): 1A; Forward Voltage (Vf@If): 550mV@1A
L201 = YNR4030-220M: LCSC Part Name: 22uH ±20% 1A 225mΩ; Supplier Part: C341013; Manufacturer: YJYCOIN(益嘉源); Supplier Footprint: SMD,4x4x3mm; JLCPCB Part Class: Extended Part; Datasheet: https://atta.szlcsc.com/upload/public/pdf/source/20200623/C340386_9AA10DB3E9692149FF2BB278AFBCE083.pdf; Supplier: LCSC; Tolerance: ±20%; Rated Current: 1A; DC Resistance (DCR): 225mΩ
P201 = 0.5-10P上接: LCSC Part Name: 0.5mm P数:10 抽屉式 上接; Supplier Part: C11085; Manufacturer: BOOMELE(博穆精密); Supplier Footprint: SMD,P=0.5mm; JLCPCB Part Class: Extended Part; Datasheet: https://atta.szlcsc.com/upload/public/pdf/source/20130129/1457706582552.pdf; Supplier: LCSC; Pitch: 0.5mm; Number of Contacts: 10; Locking Feature: 抽屉式; Mounting Type: 卧贴; Contact Type: 上接; Height Above Board: 2mm
U201 = TF-01A
U203 = MT9201
D206 = LED_0603-R: Supplier Footprint: 0603
D301 = SS34A_C211775: LCSC Part Name: 40V 3A 500mV@3A; Supplier Part: C211775; Manufacturer: YANGJIE(扬杰); Supplier Footprint: SMA; JLCPCB Part Class: Extended Part; Datasheet: https://atta.szlcsc.com/upload/public/pdf/source/20190516/C211775_5CF5F6A2E43CD0CA4A389CCA8A88582C.pdf; Supplier: LCSC; Reverse Voltage (Vr): 40V; Average Rectified Current (Io): 3A; Forward Voltage (Vf@If): 500mV@3A
H301 = typec-31-e-11
H302-H305 = Single_Pin
L301 = SCCD54-4R7MT: LCSC Part Name: 4.7uH ±20% 2.5A 38mΩ; Supplier Part: C532870; Manufacturer: Yanchuang(研创); Supplier Footprint: SMD; JLCPCB Part Class: Extended Part; Datasheet: https://atta.szlcsc.com/upload/public/pdf/source/20200515/C532850_02BFFFF91E0F9B1D12EE1A1A1220C654.pdf; Supplier: LCSC; Tolerance: ±20%; Rated Current: 2.5A; DC Resistance (DCR): 38mΩ
U301 = CS5095E
Q401 Q405 = MMBT3904: Supplier Part: C84104; Manufacturer: ST(先科); Supplier Footprint: SOT-23(SOT-23-3); JLCPCB Part Class: Extended Part; Datasheet: https://atta.szlcsc.com/upload/public/pdf/source/20161024/1477288599731.pdf; Supplier: LCSC; Transistor Type: NPN; Collector-Emitter Breakdown Voltage (Vceo): 40V; Collector Current (Ic): 200mA; Power Dissipation (Pd): 350mW; Collector Cut-Off Current (Icbo): 50nA; Collector-Emitter Saturation Voltage (VCE(sat)@Ic,Ib): 300mV@50mA,5mA; DC Current Gain (hFE@Ic,Vce): 100@10mA,1V; Transition Frequency (fT): 300MHz; Operating Temperature: +150℃@(Tj)
Q402 = MMBT3906-7-F: Supplier Part: C82762; Manufacturer: DIODES(美台); Supplier Footprint: SOT-23(SOT-23-3); JLCPCB Part Class: Extended Part; Datasheet: https://atta.szlcsc.com/upload/public/pdf/source/20171221/C82762_15138313065711195601.pdf; Supplier: LCSC; Transistor Type: PNP; Collector-Emitter Breakdown Voltage (Vceo): 40V; Collector Current (Ic): 200mA; Power Dissipation (Pd): 300mW; Collector-Emitter Saturation Voltage (VCE(sat)@Ic,Ib): 400mV@50mA,5mA; DC Current Gain (hFE@Ic,Vce): 100@10mA,1V; Transition Frequency (fT): 250MHz; Operating Temperature: -55℃~+150℃@(Tj)
Q403 = AO3402A: Supplier Part: C347477; Manufacturer: UMW(友台半导体); Supplier Footprint: SOT-23; JLCPCB Part Class: Extended Part; Datasheet: https://atta.szlcsc.com/upload/public/pdf/source/20190109/C347477_203244A660E0B7D1849BF8F36C695C58.pdf; Supplier: LCSC
Q404 = AO3401A_C347476: Supplier Part: C347476; Manufacturer: UMW(友台半导体); Supplier Footprint: SOT-23; JLCPCB Part Class: Extended Part; Datasheet: https://atta.szlcsc.com/upload/public/pdf/source/20190827/C347476_6CCC01FEC3E3D166C83BA0E415FD2056.pdf; Supplier: LCSC
U401 = LM321-TR_C97688: Supplier Part: C97688; Manufacturer: 3PEAK; Supplier Footprint: SOT-23-5; JLCPCB Part Class: Extended Part; Datasheet: https://atta.szlcsc.com/upload/public/pdf/source/20170322/1490151696478.pdf; Supplier: LCSC; Amplifier Type: General Purpose; Number of Circuits: 1; Gain Bandwidth Product（GBP）: 1.2MHz; Slew Rate（SR）: 0.55 V/us; Supply Voltage（Single）: 3V ~ 36V, ±1.5V ~ 18V; Iq per channel (Typ): 200μA
H501 = AFC01-S24FCA-00: LCSC Part Name: 0.5mm P数:24P 翻盖式 下接; Supplier Part: C262669; Manufacturer: JS(钜硕电子); Supplier Footprint: SMD,P=0.5mm; JLCPCB Part Class: 扩展库; Datasheet: https://atta.szlcsc.com/upload/public/pdf/source/20190816/C413942_2A72D1AC756EAE17EEDF756A339D4500.pdf; Supplier: LCSC; Pitch: 0.5mm; Number of Contacts: 24P; Locking Feature: 翻盖式; Mounting Type: 卧贴; Contact Type: 下接; Height Above Board: 2mm; FFC, FCB Thickness: 0.3mm
L501 L502 = 暖白3528LED灯珠: LCSC Part Name: 暖白 3528 LED灯珠; Supplier Part: C26545; Supplier Footprint: 3528; JLCPCB Part Class: Extended Part; Supplier: LCSC
Q501 = AO3404A: LCSC Part Name: N沟道 30V 5.8A; Supplier Part: C30010; Manufacturer: AOS; Supplier Footprint: SOT-23-3L; JLCPCB Part Class: Extended Part; Datasheet: https://atta.szlcsc.com/upload/public/pdf/source/20191220/C30010_DF67985E36B4CD05195D0D938BA71633.pdf; Supplier: LCSC; Type: N沟道; Drain Source Voltage (Vdss): 30V; Continuous Drain Current (Id): 5.8A; Power Dissipation (Pd): 1.4W; Drain Source On Resistance (RDS(on)@Vgs,Id): 28mΩ@10V,5.8A; Gate Threshold Voltage (Vgs(th)@Id): 3V@250μA
U502 U503 = XC6206-2.8V: Supplier Part: C2892669; Manufacturer: YONGYUTAI(永裕泰); Supplier Footprint: SOT-23-3L; JLCPCB Part Class: 扩展库; Datasheet: https://atta.szlcsc.com/upload/public/pdf/source/20210901/DE3C77F0CE73FFE8F7C655BE9B94CB06.pdf; Supplier: LCSC; Output Type: 固定; Output Polarity: 正; Number of Outputs: 1; Maximum Input Voltage: 6V; Output Voltage: 2.8V; Output Current: 250mA; Operating Temperature: -40℃~+85℃@(Tj)
X501 = OT2EL4C4JI-111OLP-24M: LCSC Part Name: 24MHZ 1.8V-3.3V ±10PPM YSO110TR; Supplier Part: C5203548; Manufacturer: YXC(扬兴晶振); Supplier Footprint: SMD3225-4P; JLCPCB Part Class: 扩展库; Datasheet: https://atta.szlcsc.com/upload/public/pdf/source/20231227/5563D7688935AB8F439681C72F60F823.pdf; Supplier: LCSC; Normal temperature Frequency Tolerance: ±10ppm; Output Type: CMOS; Supply Voltage: 1.8V~3.3V; Operating Temperature: -40℃~+85℃
C601 C602 = CGA0603X7R104K500JT: LCSC Part Name: 100nF ±10% 50V; Supplier Part: C6119867; Manufacturer: HRE(芯声); Supplier Footprint: 0603; JLCPCB Part Class: 扩展库; Datasheet: https://item.szlcsc.com/datasheet/CGA0603X7R104K500JT/7062573.html; Supplier: LCSC; Tolerance: ±10%; Voltage Rating: 50V; Temperature Coefficient: X7R
U601 = SC7A20HTR

## Nets
+5V: C006.1 C012.1 F001.1 H002.10 H003.1 H006.1 H007.1(VCC) H008.1 H011.5 J007.2 L001.1 Q001.2(E) R002.1 U004.2(+5V) U005.4(VCC)
+12V: C010.1 C011.2 Q002.5(D) Q002.6(D) Q002.7(D) Q002.8(D) U004.1(IN)
GND: C001.2 C002.2 C003.1 C004.1 C005.1 C006.2 C007.1 C008.1 C009.1 C010.2 C011.1 C012.2 H001.6 H002.9 H003.6 H006.10 H007.6(GND) H008.18 H009.2 H010.6(GND) H011.1 H011.6 H011.7 H012.13(GND) H012.14(GND) H012.15(GND) H012.16(GND) H012.A1B12(GND) H012.B1A12(GND) J001.13 J001.14 J002.14 J003.13 J003.14 J004.2 J005.3 J007.14 Q003.2(E) R008.1 R009.1 S001.2 S001.3 S001.4 S003.1 S003.3 S003.4 S004.1 S004.3 S004.4 U001.1(GND) U001.40(GND) U001.41(GND) U002.11(GND) U003.1(VSS) U004.3(GND) U004.4(GND) U005.3(GND)
VCC: C001.1 C002.1 C004.2 C005.2 C008.2 C009.2 H001.2 H009.1 H010.8(3.3V) J001.1 J002.1 J003.1 J005.1 J007.1 Q001.3(C) R001.2 R005.2 R006.2 R007.2 U001.2(3V3) U002.17(VCC) U002.35(VDD) U003.3(VOUT)
BTN_DN: S004.2 U002.3(PA1/PWM1/INT1)
BTN_UP: S003.2 U002.2(PA0/PWM0/INT0)
CAM_1V2: C509.1 C510.1 H501.10 U503.2(VOUT)
CAM_2V8: C506.1 C507.1 H501.4 U502.2(VOUT)
CAM_3V3: C503.2 C504.2 C505.2 C508.2 C511.2 C512.1 H501.11 R501.2 U501.3(VOUT) U502.3(VIN) U503.3(VIN) X501.4(VDD)
CAM_5V0: C501.2 C502.2 H502.1 L501.1(A) L502.1(A) U501.2(VIN)
CAM_D0: H501.19 H502.13
CAM_D1: H501.21 H502.15
CAM_D2: H501.22 H502.16
CAM_D3: H501.20 H502.14
CAM_D4: H501.18 H502.12
CAM_D5: H501.16 H502.11
CAM_D6: H501.14 H502.10
CAM_D7: H501.12 H502.9
CAM_GND: C501.1 C502.1 C503.1 C504.1 C505.1 C506.2 C507.2 C508.1 C509.2 C510.2 C511.1 C512.2 C513.1 H501.2 H501.15 H501.25 H501.26 H502.18 Q501.2(S) R504.1 U501.1(VSS) U502.1(VSS) U503.1(VSS) X501.2(GND)
CAM_HREF: H501.9 H502.7
CAM_PCLK: H501.17 H502.8
CAM_PWDN: H501.8 H502.5
CAM_RESET: H501.6 H502.3
CAM_SIOC: H501.5 H502.4
CAM_SIOD: H501.3 H502.2
CAM_VSYNC: H501.7 H502.6
CAM_XCLK: H501.13 R506.1
CMA_LIGHT: H502.17 R505.2
DEBUG_3V3: H103.3 H103.4 H103.6
DEBUG_5V0: H103.1 H103.2 H104.1
DEBUG_BOOT: H104.2 Q103.3(C)
DEBUG_DTR: H103.10 Q103.2(E) R109.1
DEBUG_GND: H103.5 H104.6
DEBUG_RESEST: H104.4 Q104.3(C)
DEBUG_RTS: H103.8 Q104.2(E) R108.1
DEBUG_RXD: H103.7 H104.3
DEBUG_TXD: H103.9 H104.5
ESP_BOOT: H003.2 H010.1(RX / SDA / SS) J003.12 R007.1 U001.27(IO0)
ESP_IO1: H007.4(ADC_Out) J003.2 U001.39(IO1)
ESP_IO2: H007.5(Signal_In) J003.3 U001.38(IO2)
ESP_IO3: H008.15 J002.2 U001.15(IO3)
ESP_IO4: J001.2 J005.2 U001.4(IO4)
ESP_IO5: H008.2 H009.3 J001.3 J007.3 R006.1 U001.5(IO5)
ESP_IO6: H008.4 H009.4 J001.4 J007.5 R005.1 U001.6(IO6)
ESP_IO7: H008.7 J001.5 U001.7(IO7)
ESP_IO8: H008.13 J001.10 U001.12(IO8)
ESP_IO9: H008.6 J002.4 U001.17(IO9)
ESP_IO10: H008.8 J002.5 U001.18(IO10)
ESP_IO11: H006.2 J002.6 U001.19(IO11)
ESP_IO12: H006.3 J002.7 U001.20(IO12)
ESP_IO13: H006.4 J002.8 U001.21(IO13)
ESP_IO14: H006.5 J002.9 U001.22(IO14)
ESP_IO15: H008.9 H011.4 J001.6 U001.8(IO15)
ESP_IO16: H008.10 H011.3 J001.7 U001.9(IO16)
ESP_IO17: H008.11 H011.2 J001.8 U001.10(IO17)
ESP_IO18: H008.12 J001.9 U001.11(IO18)
ESP_IO19: H008.14 H012.A7(DN1) H012.B7(DN2) J001.11 U001.13(IO19)
ESP_IO20: H008.16 H012.A6(DP1) H012.B6(DP2) J001.12 U001.14(IO20)
ESP_IO21: H006.8 J002.10 U001.23(IO21)
ESP_IO35: H006.6 J003.11 U001.28(IO35)
ESP_IO36: H006.7 J003.10 U001.29(IO36)
ESP_IO37: J003.9 U001.30(IO37)
ESP_IO38: H002.5 J003.8 U001.31(IO38)
ESP_IO39: H002.3 J003.7 U001.32(IO39)
ESP_IO40: H002.1 J003.6 U001.33(IO40)
ESP_IO41: H001.3 J003.5 U001.34(IO41)
ESP_IO42: H001.1 J003.4 U001.35(IO42)
ESP_IO45: H010.2(SCK) J002.13 U001.26(IO45) U002.31(SCK)
ESP_IO46: J002.3 U001.16(IO46) U002.33(CSB)
ESP_IO47: H010.4(TX / SCL / MISO) J002.11 U001.24(IO47) U002.32(MISO)
ESP_IO48: H010.3(MOSI) J002.12 U001.25(IO48) U002.30(MOSI)
ESP_RESET: C003.2 H003.4 R001.1 S001.1 U001.3(EN)
ESP_RXD: H003.5 U001.36(RXD0)
ESP_TXD: H003.3 U001.37(TXD0)
HT517_BLCK: H102.1 U102.16(DAI0) U103.14(DAI1)
HT517_CN1_N: H102.4 U102.10(OUTN)
HT517_CN1_P: H102.2 U102.9(OUTP)
HT517_CN2_N: H102.8 U103.10(OUTN)
HT517_CN2_P: H102.6 U103.9(OUTP)
HT517_DIN: H102.5 U102.1(DAI2) U103.16(DAI0)
HT517_EN: H102.7 U102.4(EN) U103.4(EN)
HT517_GND: C103.1 C104.1 C105.1 C106.1 H102.9 R104.2 R106.2 U102.3(GND0) U102.11(GND1) U102.15(GND2) U102.17(EP) U103.3(GND0) U103.11(GND1) U103.15(GND2) U103.17(EP)
HT517_LRCK: H102.3 U102.14(DAI1) U103.1(DAI2)
HT517_VCC: C103.2 C104.2 C105.2 C106.2 H102.10 R105.2 R107.2 U102.7(VDD) U102.8(VDD1) U103.7(VDD) U103.8(VDD1)
I2S_EN: H002.7 U002.12(PB1/CMOS1_OUT)
INT_02: H008.3 J007.7 U002.4(PA2/PWM2/INT2)
INT_03: H008.5 J007.9 U002.5(PA3/PWM3/INT3)
LCD_RESET: H006.9 U002.7(PA5/PWM5)
METAL_ENABLE: H007.3(Enable) U002.13(PB2/CMOS2_IN)
MIC_CLK: H101.3 U101.4(CLK)
MIC_DAT: H101.1 U101.1(DAT)
MIC_EN: H101.5 R103.2
MIC_GND: C101.1 C102.1 H101.6 Q102.2(E) U101.3(GND)
MIC_VCC: H101.2 Q101.2(S) R101.2
P0_CMA_LIGHT: H008.17 U002.6(PA4/PWM4/INTF)
P2_3V3: C201.2 C205.2 C206.2 P201.4 R201.1 R202.2 R203.2 R204.2 R225.1 U201.4(VDD) U204.3(VOUT)
P2_5V0: C203.2 C204.2 L201.1 U203.6(VIN) U204.2(VIN) U205.1
P2_GND: C201.1 C202.1 C203.1 C204.1 C205.1 C206.1 P201.3 P201.10 P201.11 P201.12 R205.1 U201.6(VSS) U201.10(GND) U201.11(GND) U201.12(GND) U201.13(GND) U203.2(GND) U204.1(VSS) U205.10
P2_LCD_ANODE: C202.2 D201.1(K) P201.2 U203.5(OV)
P2_LCD_CATHODE: P201.1 R205.2 U203.3(FB)
P2_LCD_CS: P201.8 U205.8
P2_LCD_RESET: P201.9 U205.9
P2_LCD_RS: P201.5 U205.5
P2_LCD_SCL: P201.7 U205.7
P2_LCD_SDA: P201.6 U205.6
P2_SD_CLK: R203.1 U201.5(CLK(SCLK)) U205.3
P2_SD_CMD: R202.1 U201.3(CMD(DI)) U205.2
P2_SD_DAT: R204.1 U201.7(DAT0(D0)) U205.4
P4_GND: H401.6 Q401.2(E) Q403.2(S) Q405.2(E) R405.1 R409.2 R414.1 U401.2(V-)
P4_L_CATHODE: H401.2 Q403.3(D) R406.1 R407.2
P4_METAL_ADC: H401.4 R413.1 R414.2
P4_METAL_EN: H401.3 R412.1
P4_METAL_PULSE: H401.5 R401.1
P4_VCC: H401.1 Q404.2(S) R411.1
P6_3V3: C601.1 C602.2 H601.1 U601.3(VDDIO) U601.7(VDD) U601.11(NC)
P6_GND: C601.2 C602.1 H601.2 R601.1 U601.4(NC) U601.8(GNDIO) U601.9(GND)
PDM_EN: H001.5 U002.10(PB0/CMOS1_IN)
POWER_LOCK: D001.2(A) U002.14(PB3/CMOS2_OUT)
PWM_07: J007.11 U002.9(PA7/PWM7)
PWM_08: J007.13 U002.20(PC0/PWM8)
PWM_09: J007.12 U002.21(PC1/PWM9)
PWM_010: J007.10 U002.22(PC2/PWM10)
PWM_011: J007.8 U002.23(PC3/PWM11)
PWM_012: J007.6 U002.24(PC4/PWM12)
PWM_013: J007.4 U002.25(PC5/PWM13)
PWM_014: U002.26(PC6/PWM14) U005.2(IN_B)
PWM_015: U002.27(PC7/PWM15) U005.1(IN_A)
RC522_IRQ: H010.5(IRQ) U002.15(PB4/CMOS3_IN)
RC522_RST: H010.7(RST) U002.8(PA6/PWM6)
SC7A20_SCL: H601.4 U601.12(SCx)
SC7A20_SDA: H601.3 U601.2(SDx)
SPK1_N: H002.4 H004.2
SPK1_P: H002.2 H004.1
SPK2_N: H002.8 H005.2
SPK2_P: H002.6 H005.1
USB+: C301.1 H301.2(VBUS) H301.5(VBUS) L301.2 R301.2 U301.1(VIN)
USB-: C301.2 C302.2 C303.2 H301.1(GND) H301.6(GND) H301.7(SHELL) H301.8(SHELL) H304.1 H305.1 R302.1 R303.1 R304.1 R305.1 U301.2(AGND) U301.9(ThermalPad)
VBIN: C303.1 H302.1 H303.1 U301.5(BAT)
$1N5617: C007.2 Q001.1(B) R002.2 U003.2(VIN)
$1N9021: H007.2(Inductor) L001.2
$1N9369: Q002.4(G) Q003.3(C) R003.1
$1N9446: Q003.1(B) R004.1
$1N9668: D001.1(C) D002.1(C) R004.2
$1N9696: J004.1 Q002.1(S) Q002.2(S) Q002.3(S) R003.2 S002.1
$1N18392: H012.A5(CC1) R008.2
$1N18402: F001.2 H012.A4B9(VBUS) H012.B4A9(VBUS)
$1N18404: H012.B5(CC2) R009.2
$1N20301: J006.1 U005.7(OUT_A) U005.8(OUT_A)
$1N20305: J006.2 U005.5(OUT_B) U005.6(OUT_B)
$1N20758: D002.2(A) S002.2
$2N358: C101.2 C102.2 Q101.3(D) U101.2(L/R) U101.5(VDD)
$2N709: Q101.1(G) R101.1 R102.2
$2N810: Q102.3(C) R102.1
$2N897: Q102.1(B) R103.1
$2N2003: R104.1 R105.1 U102.2(GAIN/CH)
$2N2005: R106.1 R107.1 U103.2(GAIN/CH)
$2N3190: Q103.1(B) R108.2
$2N3194: Q104.1(B) R109.2
$3N1120: D201.2(A) L201.2 U203.1(SW)
$3N2623: R225.2 U203.4(EN)
$3N5060: R201.2 U201.2(CDDAT3(CS))
$4N871: Q401.1(B) R401.2
$4N873: Q401.3(C) R402.1 R403.1
$4N875: Q402.1(B) R403.2
$4N877: Q402.3(C) R404.2
$4N879: Q403.1(G) R404.1 R405.2
$4N893: C401.2 D401.1(C) D403.2(A) R407.1
$4N898: C402.1 R408.2 R409.1 U401.1(+IN)
$4N903: R410.1 R413.2 U401.4(OUT)
$4N908: C402.2 D401.2(A) D403.1(C) Q402.2(E) Q404.3(D) R402.2 R406.2 R408.1 U401.5(V+)
$4N926: C401.1 R410.2 U401.3(-IN)
$4N1398: Q404.1(G) Q405.3(C) R411.2
$4N1499: Q405.1(B) R412.2
$5N399: C302.1 D301.1(C) U301.4(VBS)
$5N401: D301.2(A) L301.1 U301.3(LX)
$5N413: D206.2(A) R301.1
$5N415: D206.1(C) U301.8(STAT)
$5N418: R302.2 U301.7(NTC)
$5N420: R303.2 U301.6(ICHG)
$5N663: H301.3(CC1) R304.2
$5N667: H301.4(CC2) R305.2
$6N1076: R501.1 X501.1(Tri-state)
$6N1779: L501.2(K) R502.2
$6N1805: L502.2(K) R503.2
$6N1887: Q501.3(D) R502.1 R503.1
$6N1935: Q501.1(G) R504.2 R505.1
$6N2239: C513.2 R506.2 X501.3(OUT)
$7N310: R601.2 U601.1(SDO)

Not connected (* = marked no-connect by the designer): H001 4*; H012 A8(SBU1)* B8(SBU2)*; H101 4*; H501 1* 23* 24*; S002 3* 4*; U102 5(NC1)* 6(NC2)* 12(NC3)* 13(NC4)*; U103 5(NC1)* 6(NC2)* 12(NC3)* 13(NC4)*; U201 1(DAT2(RSV))* 8(DAT1(RSV))* 9(CD)*; U601 5(INT1)* 6(INT2)* 10(CS)*

## Notes on the sheets
sheet 1
- RESET
- DEBUG
- MEMS MICPHONE
- USB-OTG
- Sound Amplifier
- MOT && VR
- IO - Seat
- Button
- IIC interface
- Extend IO && PWM
- G-sensor
- POWER-LOCK
- Printer_Interface
- RFID Reader
- camera
- Metal_detect
- 12V -> 5V -> 3.3V
sheet 2
- mems mic
- UART-DEBUG
- Amplifier
sheet 4
- Inductor feature:
  1. diameter : 20~30 cm
  2. number of turns: 25 ~ 30 rounds
  3. wire :  multi-strand Lite wires 0.1 * 60
- 6.83V
sheet 6
- FPC 0.5mm 24Pin 下接
- Top-Left
- AVDD
- DVDD
- DOVDD
- Top-Right
